# EAGLE design H07R8 (EAGLE 9.6.1)

## Sheet 1 of 3: I/O parts
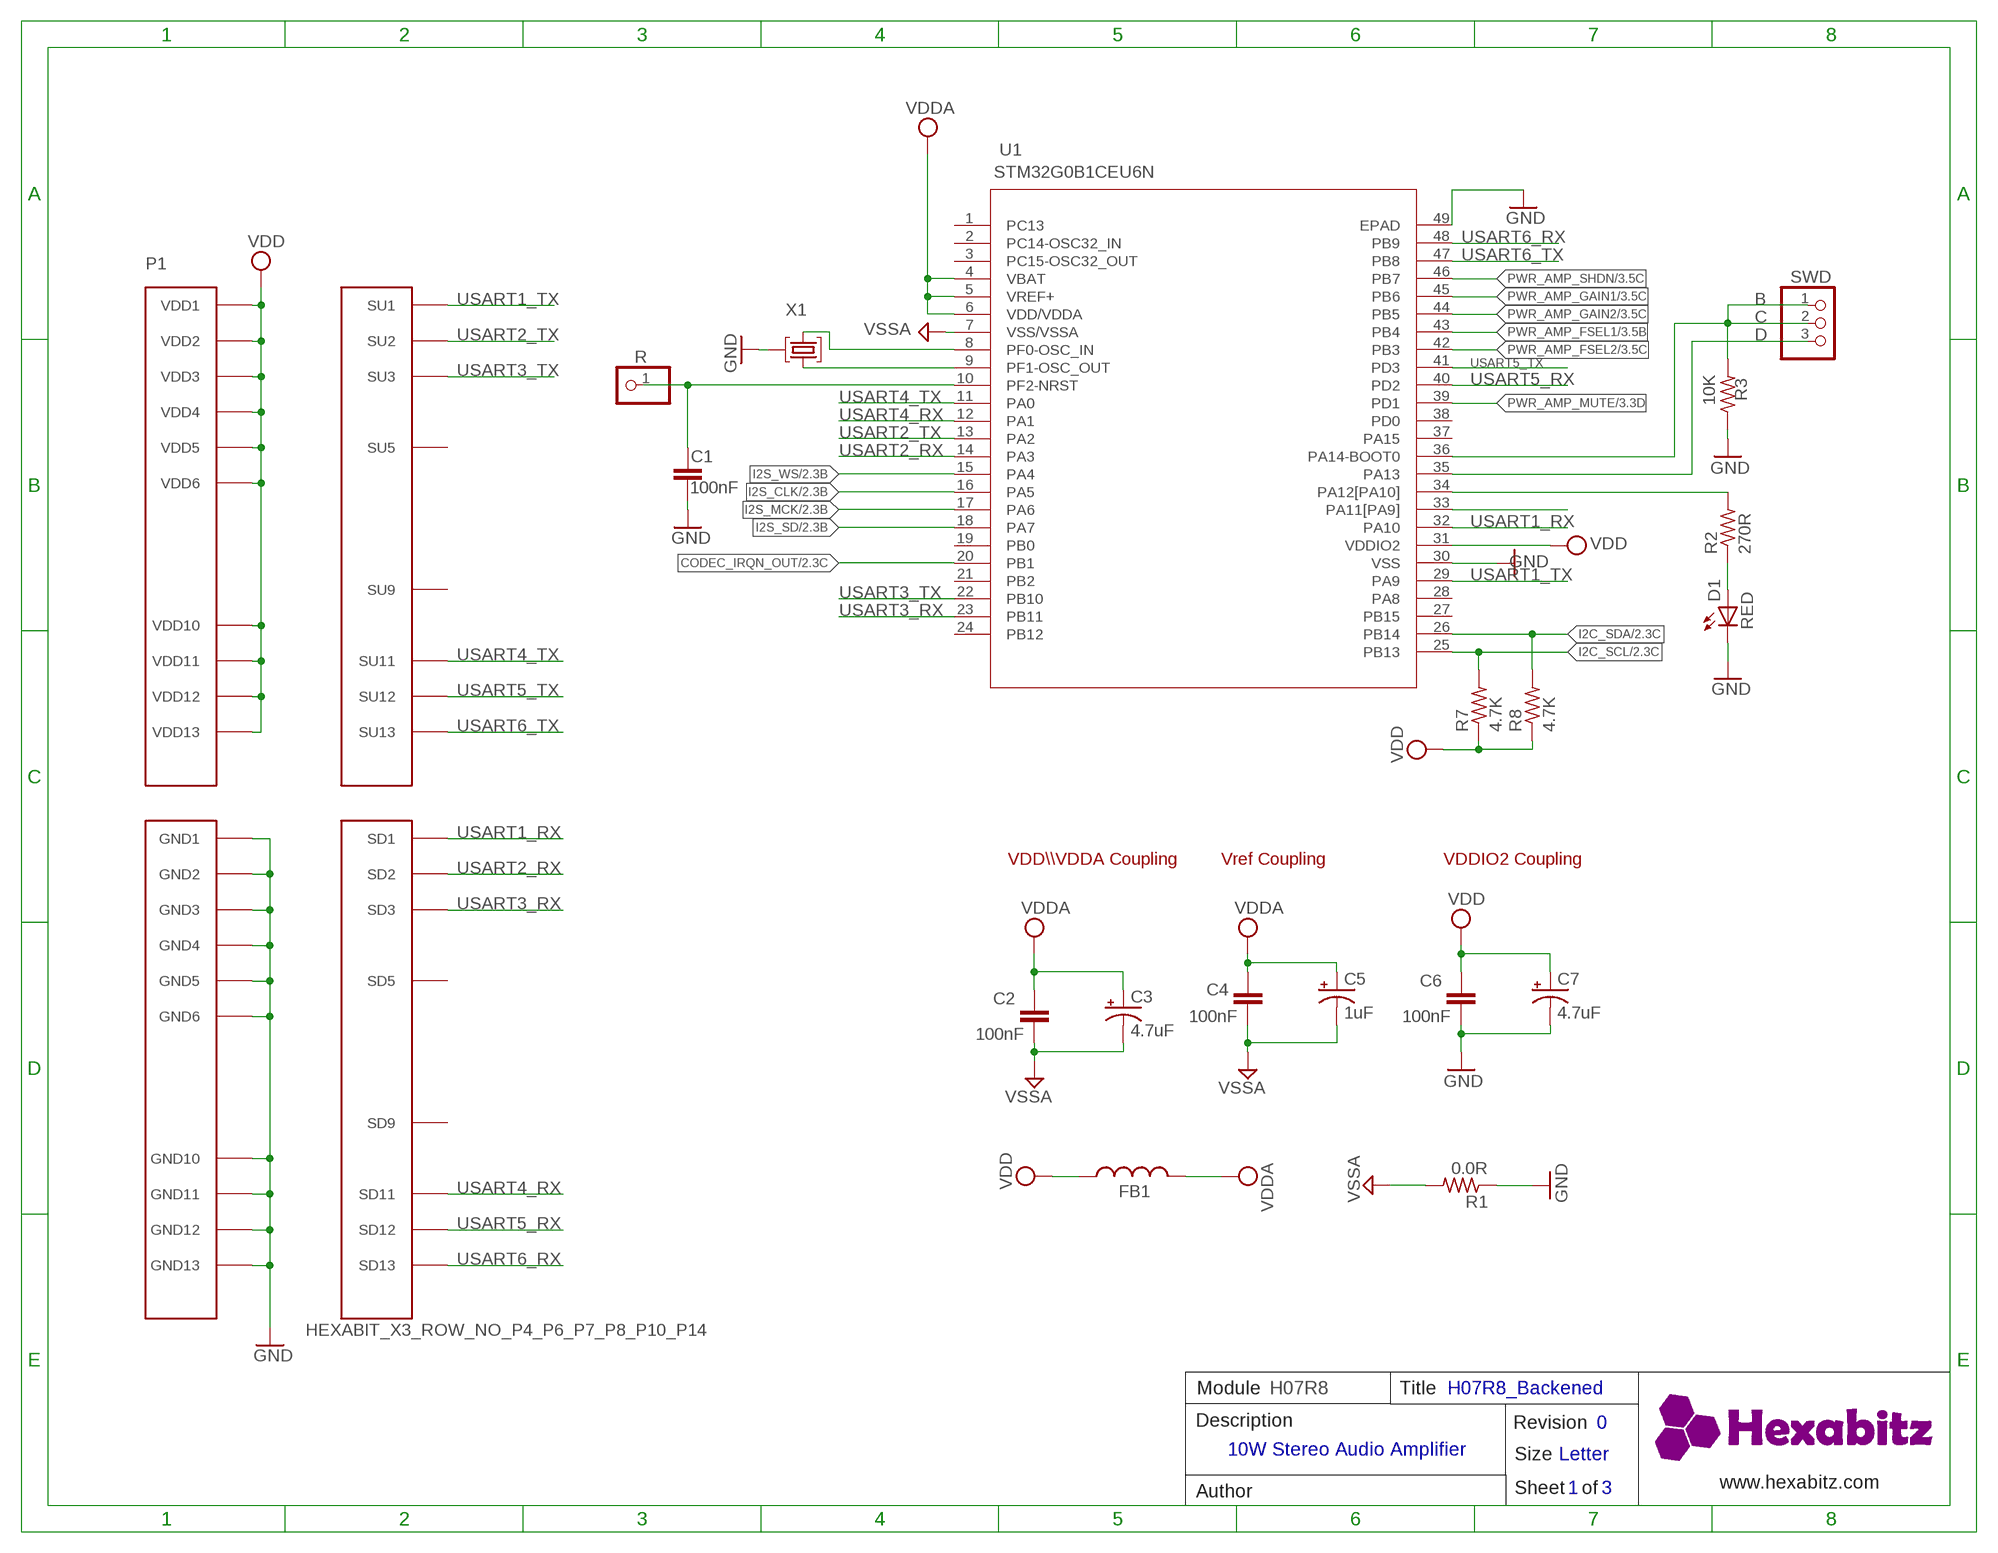
[diagram p0: schematic, sheet 1]

### Parts
C1  100nF  C-0603  [C-0603]
C2  100nF  C-0603  [C-0603]
C3  4.7uF  C-0805-POL  [C-0805-POL]
C4  100nF  C-0603  [C-0603]
C5  1uF  C-0805-POL  [C-0805-POL]
C6  100nF  C-0603  [C-0603]
C7  4.7uF  C-0805-POL  [C-0805-POL]
D1  RED  VLMS1300-GS08  [VLMS1300-GS08]
FB1  FB-TDK_MMZ1608Y300B  [FB-TDK_MMZ1608Y300B]
P1  HEXABIT_X3_ROW_NO_P4_P6_P7_P8_P10_P14  [HEXABIT_X3_ROW_NO_P4_P6_P7_P8_P10_P14]
R  PINHD-1X1  [1X01]
R1  0.0R  R-0603  [R-0603]
R2  270R  R-0603  [R-0603]
R3  10K  R-0603  [R-0603]
R7  4.7K  R-0603  [R-0603]
R8  4.7K  R-0603  [R-0603]
SWD  PINHD-1X3  [1X03]
U1  STM32G0B1CEU6N  [HEXABITZ_ICS_QFN_B1CEU6_STM-L]
X1  8MHZ  XTALL_CSTCE8M00G52  [XTALL_CSTCE8M00G52]

### Nets
C: R3.2 SWD.1 SWD.2 U1.36(PA14-BOOT0)
CODEC_IRQN_OUT: U1.20(PB1) ; also sheet 2
D: SWD.3 U1.35(PA13)
GND: C1.1 C6.1 C7.2(-) D1.C P1.PAD_PD15(GND1) P1.PAD_PD16(GND2) P1.PAD_PD17(GND3) P1.PAD_PD18(GND4) P1.PAD_PD19(GND5) P1.PAD_PD24(GND6) P1.PAD_PD25(GND10) P1.PAD_PD26(GND11) P1.PAD_PD27(GND12) P1.PAD_PD28(GND13) R1.1 R3.1 U1.30(VSS) U1.49(EPAD) X1.P$2
GND1: C2.1 C3.2(-) C4.1 C5.2(-) R1.2 U1.7(VSS/VSSA) ; supply symbol labelled VSSA ; also sheet 2,3
I2C_SCL: R7.2 U1.25(PB13) ; also sheet 2
I2C_SDA: R8.2 U1.26(PB14) ; also sheet 2
I2S_CLK: U1.16(PA5) ; also sheet 2
I2S_MCK: U1.17(PA6) ; also sheet 2
I2S_SD: U1.18(PA7) ; also sheet 2
I2S_WS: U1.15(PA4) ; also sheet 2
N$1: U1.8(PF0-OSC_IN) X1.P$1
N$2: U1.9(PF1-OSC_OUT) X1.P$3
N$3: R2.2 U1.34(PA12[PA10])
N$4: D1.A R2.1
N$12: C1.2 R.1 U1.10(PF2-NRST)
N$45: U1.33(PA11[PA9])
PWR_AMP_FSEL1: U1.43(PB4) ; also sheet 3
PWR_AMP_FSEL2: U1.42(PB3) ; also sheet 3
PWR_AMP_GAIN1: U1.45(PB6) ; also sheet 3
PWR_AMP_GAIN2: U1.44(PB5) ; also sheet 3
PWR_AMP_MUTE: U1.39(PD1) ; also sheet 3
PWR_AMP_SHDN: U1.46(PB7) ; also sheet 3
USART1_RX: P1.PAD_PD1(SD1) U1.32(PA10)
USART1_TX: P1.PAD_PU1(SU1) U1.29(PA9)
USART2_RX: P1.PAD_PD2(SD2) U1.14(PA3)
USART2_TX: P1.PAD_PU2(SU2) U1.13(PA2)
USART3_RX: P1.PAD_PD3(SD3) U1.23(PB11)
USART3_TX: P1.PAD_PU3(SU3) U1.22(PB10)
USART4_RX: P1.PAD_PD11(SD11) U1.12(PA1)
USART4_TX: P1.PAD_PU11(SU11) U1.11(PA0)
USART5_RX: P1.PAD_PD12(SD12) U1.40(PD2)
USART5_TX: P1.PAD_PU12(SU12) U1.41(PD3)
USART6_RX: P1.PAD_PD13(SD13) U1.48(PB9)
USART6_TX: P1.PAD_PU13(SU13) U1.47(PB8)
VDD: C6.2 C7.1(+) FB1.1 P1.PAD_PU15(VDD1) P1.PAD_PU16(VDD2) P1.PAD_PU17(VDD3) P1.PAD_PU18(VDD4) P1.PAD_PU19(VDD5) P1.PAD_PU24(VDD6) P1.PAD_PU25(VDD10) P1.PAD_PU26(VDD11) P1.PAD_PU27(VDD12) P1.PAD_PU28(VDD13) R7.1 R8.1 U1.31(VDDIO2) ; also sheet 2,3
VDDA: C2.2 C3.1(+) C4.2 C5.1(+) FB1.2 U1.4(VBAT) U1.5(VREF+) U1.6(VDD/VDDA)
Unconnected: P1.PAD_PD5(SD5) P1.PAD_PD9(SD9) P1.PAD_PU9(SU5) P1.PAD_PU10(SU9) U1.1(PC13) U1.2(PC14-OSC32_IN) U1.3(PC15-OSC32_OUT) U1.19(PB0) U1.21(PB2) U1.24(PB12) U1.27(PB15) U1.28(PA8) U1.37(PA15) U1.38(PD0)

### Notes on the sheet
- B
- VDD\\\VDDA Coupling | Vref Coupling | VDDIO2 Coupling
- Module | H07R8 | Title | H07R8_Backened
- Description | Revision | 0
- 10W Stereo Audio Amplifier
- Size | Letter
- www.hexabitz.com
- Author | Sheet   of | 1 | 3

## Sheet 2 of 3
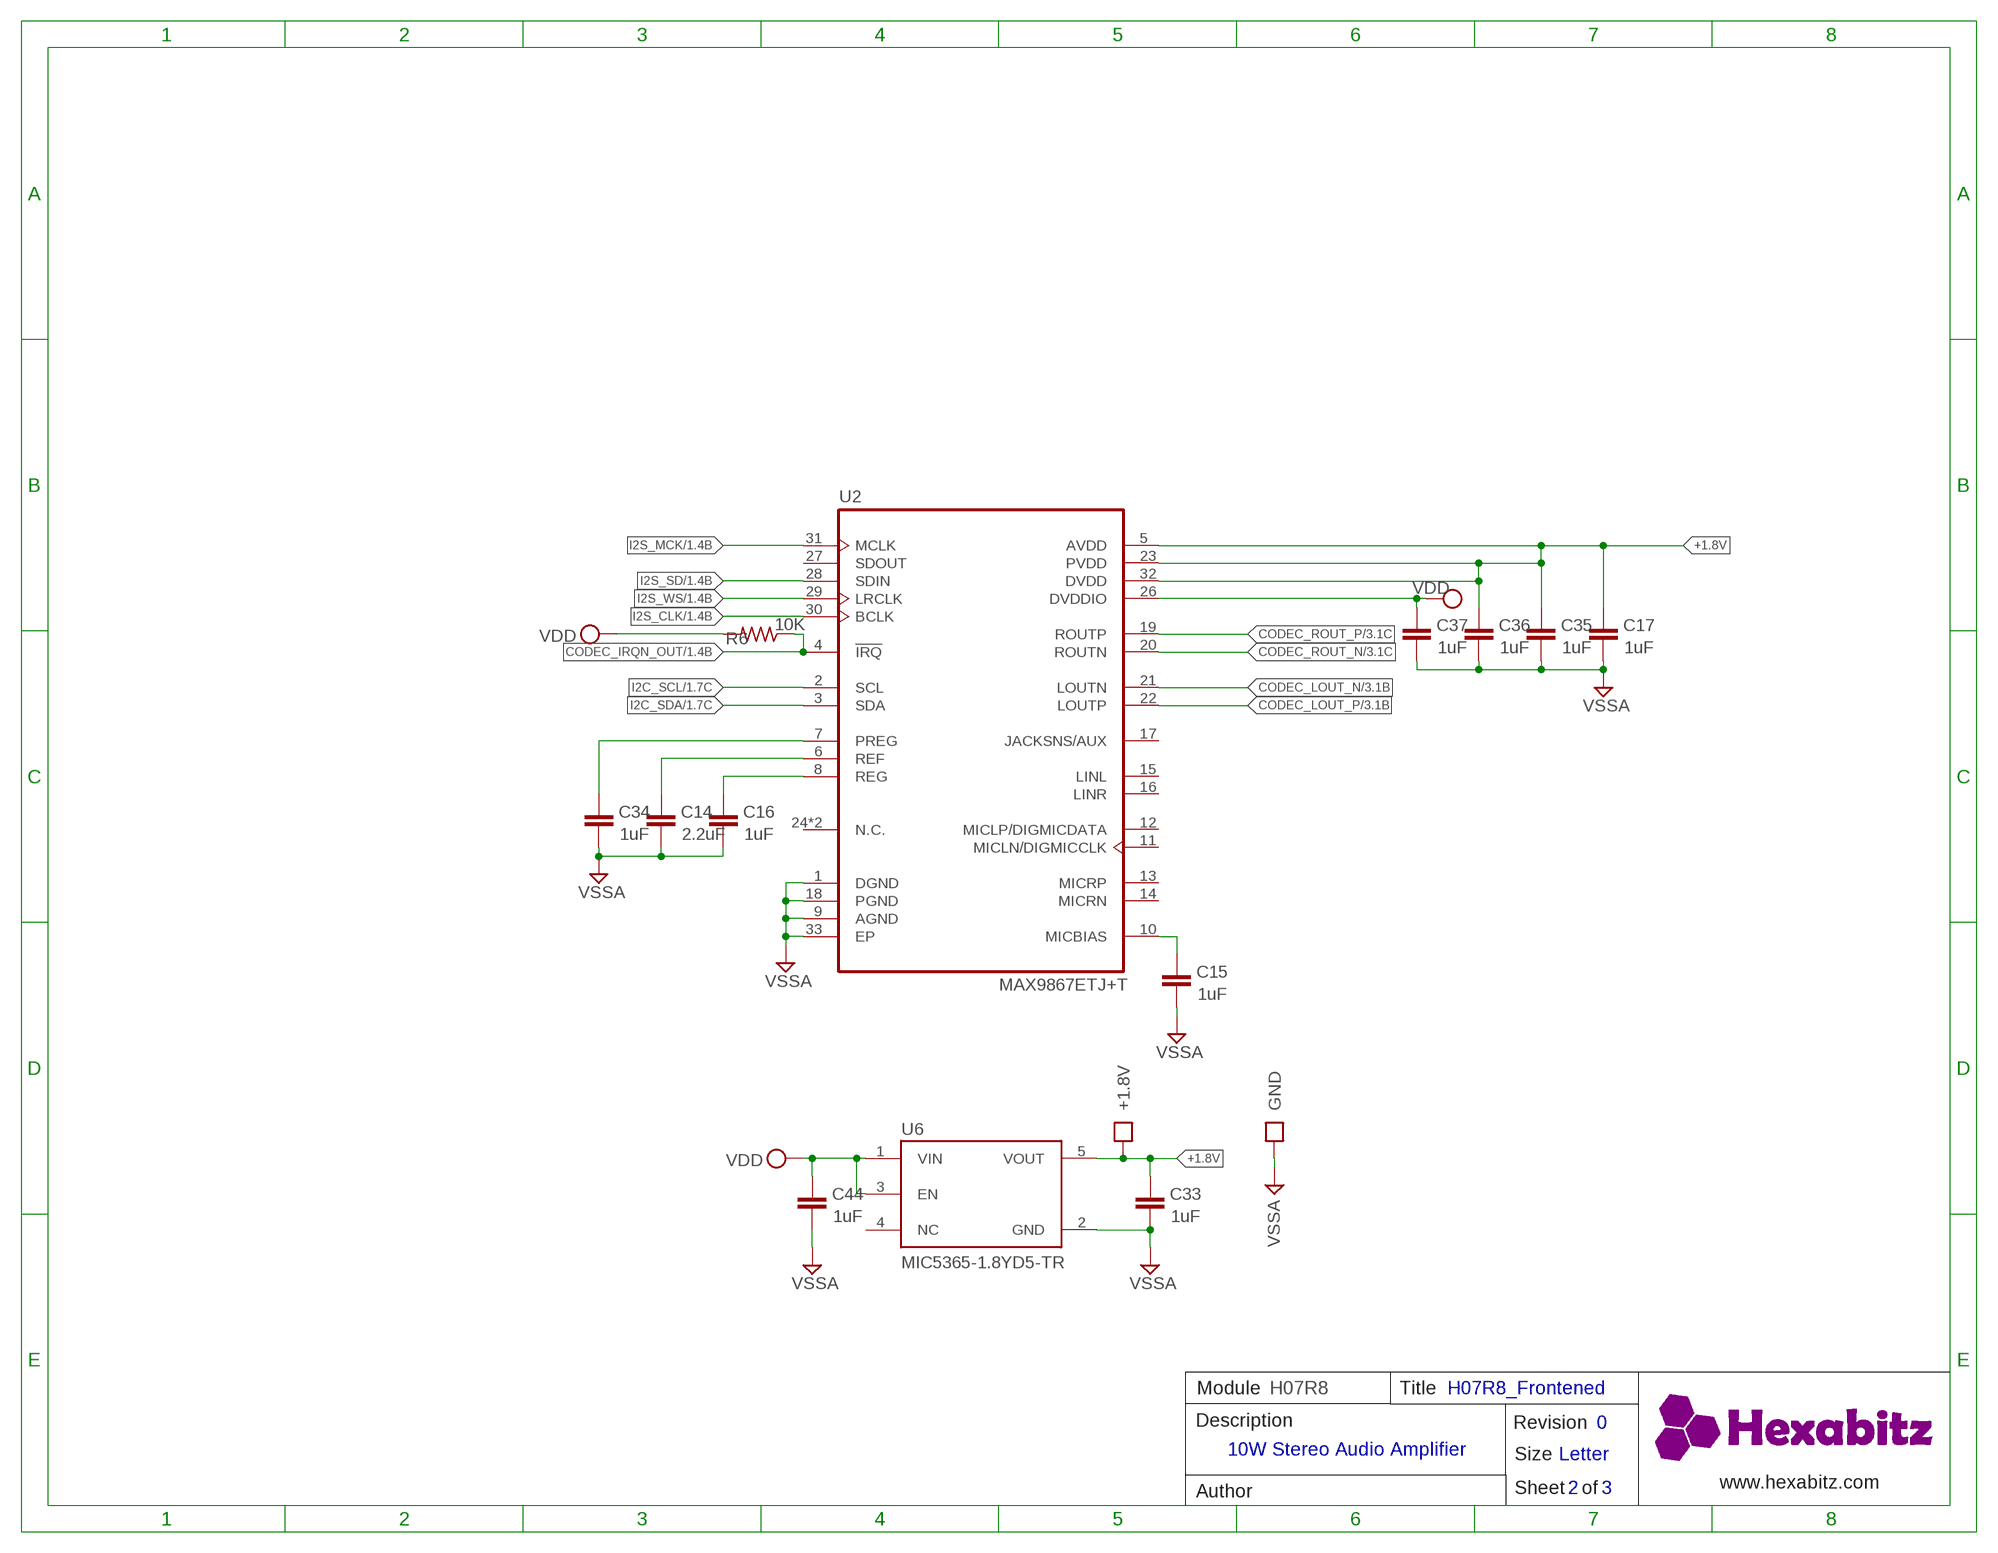
[diagram p1: schematic, sheet 2]

### Parts
+1.8V  PAD4  [PAD4]
C14  2.2uF  C-0603  [C-0603]
C15  1uF  C-0603  [C-0603]
C16  1uF  C-0603  [C-0603]
C17  1uF  C-0603  [C-0603]
C33  1uF  C-0603  [C-0603]
C34  1uF  C-0603  [C-0603]
C35  1uF  C-0603  [C-0603]
C36  1uF  C-0603  [C-0603]
C37  1uF  C-0603  [C-0603]
C44  1uF  C-0603  [C-0603]
GND  PAD4  [PAD4]
R6  10K  R-0603  [R-0603]
U2  MAX9867ETJ+T  [QFN50P500X500X80-33N]
U6  MIC5365-1.8YD5-TRMICROCHIP_MIC5365-1_8YD5-TR_0_0  [MICROCHIP_MIC5365-1_8YD5-TR_0]

### Nets
+1.8V: +1.8V.P$1 C17.2 C33.2 C35.2 C36.2 U2.5(AVDD) U2.23(PVDD) U2.32(DVDD) U6.5(VOUT)
CODEC_IRQN_OUT: R6.1 U2.4(!IRQ) ; also sheet 1
CODEC_LOUT_N: U2.21(LOUTN) ; also sheet 3
CODEC_LOUT_P: U2.22(LOUTP) ; also sheet 3
CODEC_ROUT_N: U2.20(ROUTN) ; also sheet 3
CODEC_ROUT_P: U2.19(ROUTP) ; also sheet 3
GND1: C14.1 C15.1 C16.1 C17.1 C33.1 C34.1 C35.1 C36.1 C37.1 C44.1 GND.P$1 U2.1(DGND) U2.9(AGND) U2.18(PGND) U2.33(EP) U6.2(GND) ; supply symbol labelled VSSA ; also sheet 1,3
I2C_SCL: U2.2(SCL) ; also sheet 1
I2C_SDA: U2.3(SDA) ; also sheet 1
I2S_CLK: U2.30(BCLK) ; also sheet 1
I2S_MCK: U2.31(MCLK) ; also sheet 1
I2S_SD: U2.28(SDIN) ; also sheet 1
I2S_WS: U2.29(LRCLK) ; also sheet 1
N$23: C16.2 U2.8(REG)
N$24: C14.2 U2.6(REF)
N$25: C34.2 U2.7(PREG)
N$35: C15.2 U2.10(MICBIAS)
VDD: C37.2 C44.2 R6.2 U2.26(DVDDIO) U6.1(VIN) U6.3(EN) ; also sheet 1,3
Unconnected: U2.11(MICLN/DIGMICCLK) U2.12(MICLP/DIGMICDATA) U2.13(MICRP) U2.14(MICRN) U2.15(LINL) U2.16(LINR) U2.17(JACKSNS/AUX) U2.24(N.C.) U2.25(N.C.) U2.27(SDOUT) U6.4(NC)

### Notes on the sheet
- Module | H07R8 | Title | H07R8_Frontened
- Description | Revision | 0
- 10W Stereo Audio Amplifier
- Size | Letter
- www.hexabitz.com
- Author | Sheet   of | 2 | 3

## Sheet 3 of 3
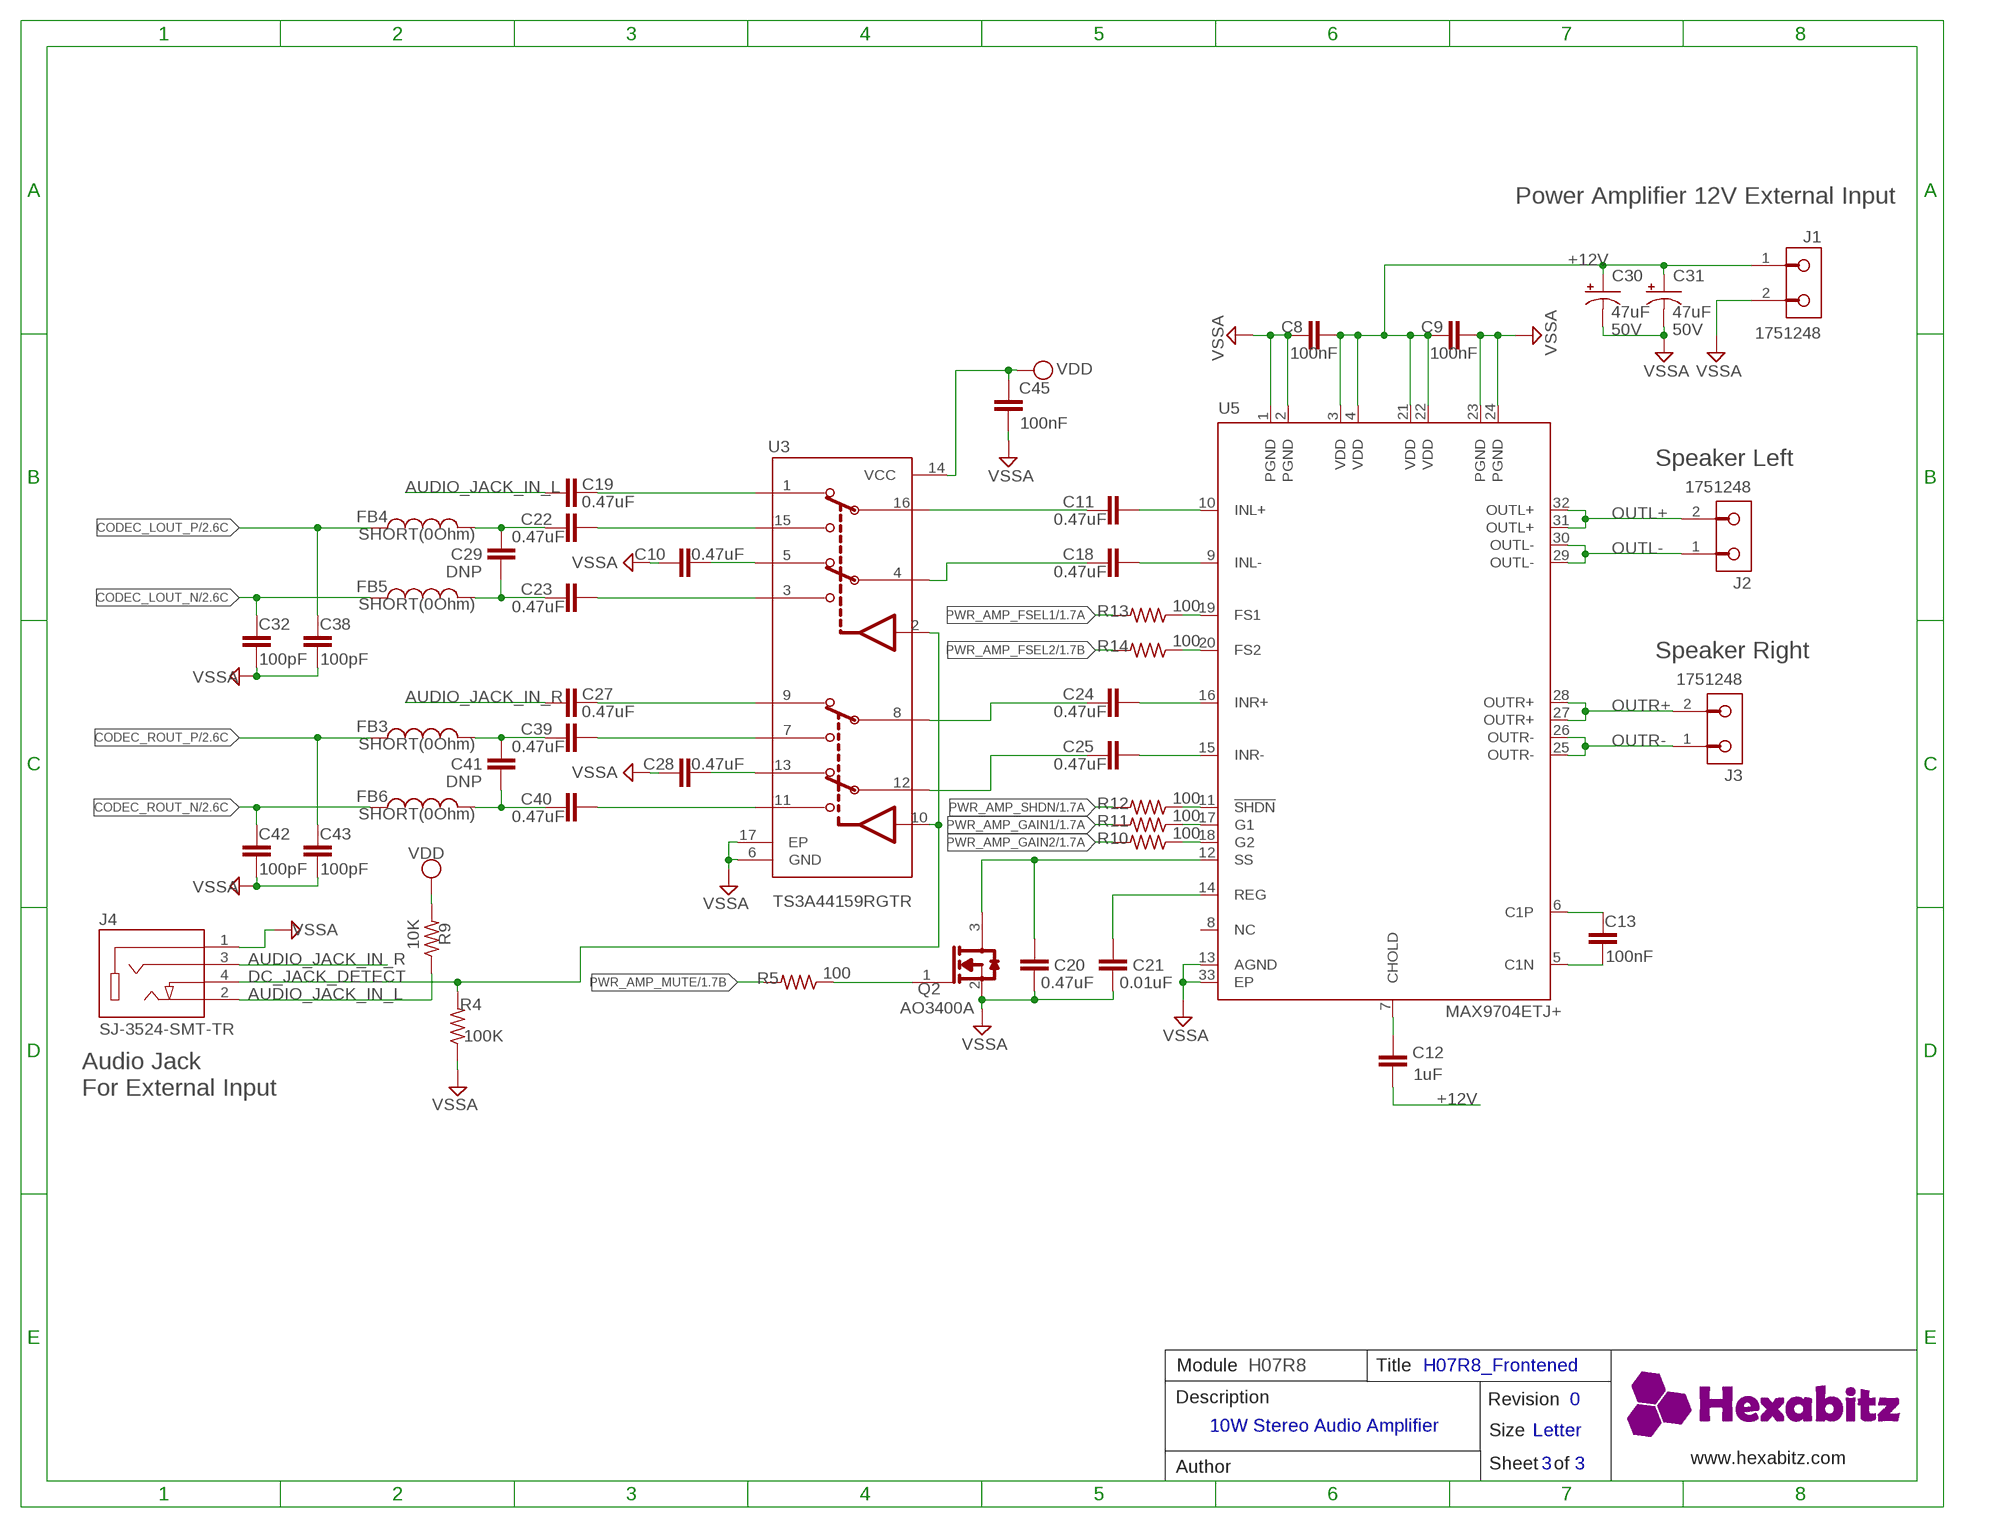
[diagram p2: schematic, sheet 3]

### Parts
C8  100nF  C-0603  [C-0603]
C9  100nF  C-0603  [C-0603]
C10  0.47uF  C-0603  [C-0603]
C11  0.47uF  C-0603  [C-0603]
C12  1uF  C-0603  [C-0603]
C13  100nF  C-0603  [C-0603]
C18  0.47uF  C-0603  [C-0603]
C19  0.47uF  C-0603  [C-0603]
C20  0.47uF  C-0603  [C-0603]
C21  0.01uF  C-0603  [C-0603]
C22  0.47uF  C-0603  [C-0603]
C23  0.47uF  C-0603  [C-0603]
C24  0.47uF  C-0603  [C-0603]
C25  0.47uF  C-0603  [C-0603]
C27  0.47uF  C-0603  [C-0603]
C28  0.47uF  C-0603  [C-0603]
C29  DNP  C-0603  [C-0603]
C30  47uF  A780EN476M1HLAS050  [PANASONIC_D]
C31  47uF  A780EN476M1HLAS050  [PANASONIC_D]
C32  100pF  C-0603  [C-0603]
C38  100pF  C-0603  [C-0603]
C39  0.47uF  C-0603  [C-0603]
C40  0.47uF  C-0603  [C-0603]
C41  DNP  C-0603  [C-0603]
C42  100pF  C-0603  [C-0603]
C43  100pF  C-0603  [C-0603]
C45  100nF  C-0603  [C-0603]
FB3  SHORT(0Ohm)  FB-0603  [FB-0603]
FB4  SHORT(0Ohm)  FB-0603  [FB-0603]
FB5  SHORT(0Ohm)  FB-0603  [FB-0603]
FB6  SHORT(0Ohm)  FB-0603  [FB-0603]
J1  1751248PHOENIX_CONTACT_1751248_0_0  [PHOENIX_CONTACT_1751248_0]
J2  1751248PHOENIX_CONTACT_1751248_0_0  [PHOENIX_CONTACT_1751248_0]
J3  1751248PHOENIX_CONTACT_1751248_0_0  [PHOENIX_CONTACT_1751248_0]
J4  SJ-3524-SMT-TR  SJ-3524-SMT-TRU  [CUI_SJ-3524-SMT]
Q2  AO3400AALPHA_&_OMEGA_SEMICONDUCTOR_AO3400A_0_0  [ALPHA_&_OMEGA_SEMICONDUCTOR_AO3400A_0]
R4  100K  R-0603  [R-0603]
R5  100  R-0603  [R-0603]
R9  10K  R-0603  [R-0603]
R10  100  R-0603  [R-0603]
R11  100  R-0603  [R-0603]
R12  100  R-0603  [R-0603]
R13  100  R-0603  [R-0603]
R14  100  R-0603  [R-0603]
U3  TS3A44159RGTRTEXAS_INSTRUMENTS_TS3A44159RGTR_0_0  [TEXAS_INSTRUMENTS_TS3A44159RGTR_0]
U5  MAX9704ETJ+  [QFN65P700X700X80-33N]

### Nets
+12V: C8.1 C9.2 C12.1 C30.+ C31.+ J1.1 U5.3(VDD) U5.4(VDD) U5.21(VDD) U5.22(VDD)
AUDIO_JACK_IN_L: C19.1 J4.2 R9.1
AUDIO_JACK_IN_R: C27.1 J4.3
CODEC_LOUT_N: C32.2 FB5.1 ; also sheet 2
CODEC_LOUT_P: C38.2 FB4.1 ; also sheet 2
CODEC_ROUT_N: C42.2 FB6.1 ; also sheet 2
CODEC_ROUT_P: C43.2 FB3.1 ; also sheet 2
DC_JACK_DETECT: J4.4 R4.2 U3.2(IN1-2) U3.10(IN3-4)
GND1: C8.2 C9.1 C10.1 C20.2 C21.2 C28.1 C30.- C31.- C32.1 C38.1 C42.1 C43.1 C45.2 J1.2 J4.1 Q2.2(S) R4.1 U3.6(GND) U3.17(EP) U5.1(PGND) U5.2(PGND) U5.13(AGND) U5.23(PGND) U5.24(PGND) U5.33(EP) ; supply symbol labelled VSSA ; also sheet 1,2
N$5: C40.1 C41.1 FB6.2
N$6: C21.1 U5.14(REG)
N$7: C12.2 U5.7(CHOLD)
N$8: C22.2 U3.15(NO1)
N$9: C23.2 U3.3(NO2)
N$10: C13.1 U5.6(C1P)
N$11: C39.2 U3.7(NO3)
N$13: C40.2 U3.11(NO4)
N$14: C19.2 U3.1(NC1)
N$15: C13.2 U5.5(C1N)
N$17: C27.2 U3.9(NC3)
N$18: C22.1 C29.2 FB4.2
N$19: C23.1 C29.1 FB5.2
N$20: C39.1 C41.2 FB3.2
N$21: C10.2 U3.5(NC2)
N$22: C28.2 U3.13(NC4)
N$26: C11.2 U5.10(INL+)
N$27: C11.1 U3.16(COM1)
N$28: C18.1 U3.4(COM2)
N$29: C24.1 U3.8(COM3)
N$30: C25.1 U3.12(COM4)
N$33: C18.2 U5.9(INL-)
N$34: C24.2 U5.16(INR+)
N$36: C20.1 Q2.3(D) U5.12(SS)
N$37: C25.2 U5.15(INR-)
N$39: R13.1 U5.19(FS1)
N$40: R14.1 U5.20(FS2)
N$41: R12.1 U5.11(!SHDN!)
N$42: R11.1 U5.17(G1)
N$43: R10.1 U5.18(G2)
N$44: Q2.1(G) R5.1
OUTL+: J2.2 U5.31(OUTL+) U5.32(OUTL+)
OUTL-: J2.1 U5.29(OUTL-) U5.30(OUTL-)
OUTR+: J3.2 U5.27(OUTR+) U5.28(OUTR+)
OUTR-: J3.1 U5.25(OUTR-) U5.26(OUTR-)
PWR_AMP_FSEL1: R13.2 ; also sheet 1
PWR_AMP_FSEL2: R14.2 ; also sheet 1
PWR_AMP_GAIN1: R11.2 ; also sheet 1
PWR_AMP_GAIN2: R10.2 ; also sheet 1
PWR_AMP_MUTE: R5.2 ; also sheet 1
PWR_AMP_SHDN: R12.2 ; also sheet 1
VDD: C45.1 R9.2 U3.14(VCC) ; also sheet 1,2
Unconnected: U5.8(NC)

### Notes on the sheet
- Power Amplifier 12V External Input
- Speaker Left
- Speaker Right
- Audio Jack
  For External Input
- Module | H07R8 | Title | H07R8_Frontened
- Description | Revision | 0
- 10W Stereo Audio Amplifier
- Size | Letter
- www.hexabitz.com
- Author | Sheet   of | 3 | 3

## Library data of the parts
+1.8V GND = HEXABITZ_CONNECTION_PARTS:PAD4
C1 = HEXABITZ_RCLS:C-0603: CAP CER 10% X7R 0603; CAPACITANCE: 100nF; MFN: AVX CORPORATION; MPN: 0603YC104K4T2A; OCTOPART_URL: 'https://octopart.com/0603yc104k4t2a-avx+interconnect+%2F+elco-8120651; TOLERANCE: 10%; VOLTAGE_RATING: 16.0 V
C2 C4 C6 = HEXABITZ_RCLS:C-0603: CAP CER 10% X7R 0603; CAPACITANCE: 100nF; MFN: AVX CORPORATION; MPN: '0603YC104K4T2A; OCTOPART_URL: 'https://octopart.com/0603yc104k4t2a-avx+interconnect+%2F+elco-8120651; TOLERANCE: 10%; VOLTAGE_RATING: 16.0 V
C3 = HEXABITZ_RCLS:C-0805-POL: Cap Tant Solid SMD 2012; CAPACITANCE: 4.7uF; MFN: 'Panasonic; MPN: '10TPU4R7MSI; OCTOPART_URL: https://octopart.com/10tpu4r7msi-panasonic-29487748?r=sp; TOLERANCE: 20%; VOLTAGE_RATING: 10.0 V
C5 = HEXABITZ_RCLS:C-0805-POL: Cap Tant Solid SMD 2012; CAPACITANCE: 4.7uF; MFN: 'YAGEO [VA]; MPN: 'CC0805KKX7R7BB105; OCTOPART_URL: 'https://octopart.com/cc0805kkx7r7bb105-yageo-8376555?r=sp; TOLERANCE: 20%; VOLTAGE_RATING: 10.0 V
C7 = HEXABITZ_RCLS:C-0805-POL: Cap Tant Solid SMD 2012; CAPACITANCE: 1.00uF; MFN: 'Panasonic; MPN: '10TPU4R7MSI; OCTOPART_URL: https://octopart.com/10tpu4r7msi-panasonic-29487748?r=sp; TOLERANCE: 10%; VOLTAGE_RATING: 16.0 V
C8 C9 C13 C45 = HEXABITZ_RCLS:C-0603: CAP CER 10% X7R 0603; CAPACITANCE: 100nF; MFN: Samsung Electro-Mechanics; MPN: CL10B104KA8NNNC; OCTOPART_URL: https://octopart.com/cl10b104ka8nnnc-samsung-19831573?r=sp; TOLERANCE: 10%; VOLTAGE_RATING: 25.0 V
C10 C11 C18-C20 C22-C25 C27 C28 C39 C40 = HEXABITZ_RCLS:C-0603: CAP CER 10% X7R 0603; CAPACITANCE: 0.47uF; MFN: TDK Corporation; MPN: C1608X5R1E474K080AC; OCTOPART_URL: https://octopart.com/c1608x5r1e474k080ac-tdk-25947645?r=sp; TOLERANCE: 10%; VOLTAGE_RATING: 25.0 V
C12 C15-C17 C33-C37 C44 = HEXABITZ_RCLS:C-0603: CAP CER 10% X7R 0603; CAPACITANCE: 1uF; MFN: Taiyo Yuden; MPN: UMK107BJ105KA-T; OCTOPART_URL: https://octopart.com/search?q=UMK107BJ105KA-T&currency=USD&specs=0; TOLERANCE: 10%; VOLTAGE_RATING: 50V
C14 = HEXABITZ_RCLS:C-0603: CAP CER 10% X7R 0603; CAPACITANCE: 2.2uF; MFN: Samsung Electro-Mechanics; MPN: CL10A225KO8NNNC; OCTOPART_URL: https://octopart.com/search?q=CL10A225KO8NNNC&currency=USD&specs=0; TOLERANCE: 10%; VOLTAGE_RATING: 16V
C21 = HEXABITZ_RCLS:C-0603: CAP CER 10% X7R 0603; CAPACITANCE: 0.01uF; MFN: YAGEO; MPN: CC0603KRX7R9BB103; OCTOPART_URL: https://octopart.com/cc0603krx7r9bb103-yageo-192938?r=sp; TOLERANCE: 10%; VOLTAGE_RATING: 50.0 V
C29 C41 = HEXABITZ_RCLS:C-0603: CAP CER 10% X7R 0603
C30 C31 = HEXABITZ_RCLS:A780EN476M1HLAS050: CAP ALUM HYB 47UF 20% 50V SMD; CAPACITANCE: 47uF; DESCRIPTION: CAP ALUM HYB 47UF 20% 50V SMD; MNF: KEMET; MPN: A780EN476M1HLAS050; OCTOPART_URL: https://octopart.com/search?q=A780EN476M1HLAS050&currency=USD&specs=0; TOLERANCE: ±20%; VOLTAGE_RATING: 50V
C32 C38 C42 C43 = HEXABITZ_RCLS:C-0603: CAP CER 10% X7R 0603; CAPACITANCE: 100pF; MFN: YAGEO; MPN: CC0603KPX7R9BB101; OCTOPART_URL: https://octopart.com/cc0603kpx7r9bb101-yageo-25628258?r=sp; TOLERANCE: 10%; VOLTAGE_RATING: 50.0 V
D1 = HEXABITZ_USER_INTERFACE_PARTS:VLMS1300-GS08: Red 0603 130° Clear 54 mcd 2 V Surface Mount ChipLED ; Octopart Url : http://octopart.com/vlms1300-gs08-vishay-21709201; MFN: Vishay; MPN: VLMS1300-GS08; OCTOPART_URL: https://octopart.com/vlms1300-gs08-vishay-21709201?r=sp&s=0nXJNjGsSbWwqfqWlZv0EA
FB1 = HEXABITZ_RCLS:FB-TDK_MMZ1608Y300B: Ferrite Beads Multi-Layer 30Ohm 25% 100MHz 1.5A 50mOhm DCR 0603; MFN: TDK; MPN: MMZ1608Y300BTA00; OCTOPART_URL: https://octopart.com/mmz1608y300bta00-tdk-7906990?r=sp
FB3-FB6 = HEXABITZ_RCLS:FB-0603: Ferrite Beads Multi-Layer 0603; MFN: YAGEO; MPN: RC0603FR-070RL; OCTOPART_URL: https://octopart.com/rc0603fr-070rl-yageo-1180803?r=sp
J1-J3 = hexabitz_connectors:1751248: TERM BLK 2POS SIDE ENT 3.5MM PCB; AVAILABILITY: In Stock; MFG_PACKAGE_IDENT: 1751248; MNF: Phoenix Contact; MPN: 1751248; OCTOPART_URL: https://octopart.com/search?q=1751248&currency=USD&specs=0
J4 = HEXABITZ_ICs:SJ-3524-SMT-TR: https://octopart.com/search?q=SJ-3524-SMT-TR&currency=USD&specs=0; AVAILABILITY: In Stock; DESCRIPTION: CONN JACK STEREO 3.5MM SMD R/A; MNF: CUI Devices; MPN: SJ-3524-SMT-TR; OCTOPART_URL: https://octopart.com/search?q=SJ-3524-SMT-TR&currency=USD&specs=0; PRICE: 1.03
P1 = hexabitz_connectors:HEXABIT_X3_ROW_NO_P4_P6_P7_P8_P10_P14: Hexabitz Double Hexagon Module Connector Hexagon side length = 17.32mm. The following ports are removed: P5, P10, P11, P12
Q2 = HEXABITZ_ICs:AO3400A: MOSFET N-CH 30V 5.7A SOT23-3L; DESCRIPTION: MOSFET N-CH 30V 5.7A SOT23-3L; MNF: Alpha & Omega Semiconductor Inc.; MPN: AO3400A; OCTOPART_URL: https://octopart.com/ao3400a-alpha+%26+omega+semiconductor-10533924?r=spc#CadModels; PACKAGE: SOT23; PRICE: 0.44
R = HEXABITZ_USER_INTERFACE_PARTS:PINHD-1X1: PIN HEADER; MFN: TE Connectivity; MPN: 87227-1; OCTOPART_URL: https://octopart.com/87227-1-te+connectivity-39512052?r=sp
R1 = HEXABITZ_RCLS:R-0603: Thick Film Resistors - SMD 0603; MFN: YAGEO [VR]; MPN: RC0603JR-070RL; OCTOPART_URL: https://octopart.com/rc0603jr-070rl-yageo-1241539?r=sp; RESISTANCE: 0R
R2 = HEXABITZ_RCLS:R-0603: Thick Film Resistors - SMD 0603; MFN: 'Panasonic; MPN: 'ERJ-3GEYJ271V; OCTOPART_URL: https://octopart.com/erj-3geyj271v-panasonic-55560546?r=sp; RESISTANCE: 270R
R3 R6 R9 = HEXABITZ_RCLS:R-0603: Thick Film Resistors - SMD 0603; MFN: Vishay; MPN: '060300J0103T5E; OCTOPART_URL: https://octopart.com/search?q=060300J0103T5E&currency=USD&specs=0; RESISTANCE: 10K
R4 = HEXABITZ_RCLS:R-0603: Thick Film Resistors - SMD 0603; MFN: YAGEO; MPN: RC0603FR-10100KL; OCTOPART_URL: https://octopart.com/search?q=RC0603FR-10100KL&currency=USD&specs=0; RESISTANCE: 100K
R5 R10-R14 = HEXABITZ_RCLS:R-0603: Thick Film Resistors - SMD 0603; MFN: YAGEO; MPN: RMCF0603FT100R; OCTOPART_URL: https://octopart.com/search?q=RMCF0603FT100R&currency=USD&specs=0; RESISTANCE: 100
R7 R8 = HEXABITZ_RCLS:R-0603: Thick Film Resistors - SMD 0603; MFN: Stackpole Electronics Inc; MPN: RMCF0603FT4K70; OCTOPART_URL: https://octopart.com/search?q=RMCF0603FT4K70&currency=USD&specs=0; RESISTANCE: 4.7K; TOLERANCE: ±1%
SWD = pinhead:PINHD-1X3: PIN HEADER
U1 = HEXABITZ_ICs:STM32G0B1CEU6N
U2 = HEXABITZ_ICs:MAX9867ETJ+T: IC STEREO AUD CODEC LP 32TQFN; AVAILABILITY: In Stock; DESCRIPTION: IC STEREO AUD CODEC LP 32TQFN; MFN: Maxim Integrated Products; MPN: MAX9867ETJ+T; PACKAGE: 32-TQFN; PRICE: 3.72
U3 = HEXABITZ_ICs:TS3A44159RGTR: IC SWITCH SPDTX4 450MOHM 16VQFN; DESCRIPTION: IC SWITCH SPDTX4 450MOHM 16VQFN; DIGIKEY_PART_NUMBER: 296-21916-1-ND; MNF: Texas Instruments; MPN: TS3A44159RGTR; OCTOPART_URL: https://octopart.com/ts3a44159rgtr-texas+instruments-5447085?r=spc#CadModels; PACKAGE: 16VQFN
U5 = HEXABITZ_ICs:MAX9704ETJ+: IC AMP CLASS D STEREO 16W 32TQFN; AVAILABILITY: In Stock; DESCRIPTION: IC AMP CLASS D STEREO 16W 32TQFN; MFN: Analog Devices Inc./Maxim Integrated; MPN: MAX9704ETJ+; PACKAGE: 32-TQFN; PRICE: 5.86
U6 = HEXABITZ_ICs:MIC5365-1.8YD5-TR: Linear Voltage Regulator IC Positive Fixed 1 Output 150mA TSOT-23-5; AVAILABILITY: In Stock; DESCRIPTION: IC REG LIN 1.8V 150MA TSOT23-5; MFN: Microchip Technology; MPN: MIC5365-1.8YD5-TR; OCTOPART_URL: https://octopart.com/mic5365-1.8yd5-tr-microchip-66803184?r=spc#CadModels; PRICE: 0.22
X1 = HEXABITZ_OTHER_PARTS:XTALL_CSTCE8M00G52: MURATA CSTCE8M00G52-R0 RESONATOR, SMD, 8MHZ ; Octopart Url : https://octopart.com/cstce8m00g52-r0-murata-7145559; MFN: Murata; MPN: CSTNE8M00G550000R0; OCTOPART_URL: https://octopart.com/cstne8m00g550000r0-murata-91406934?r=sp

## Board
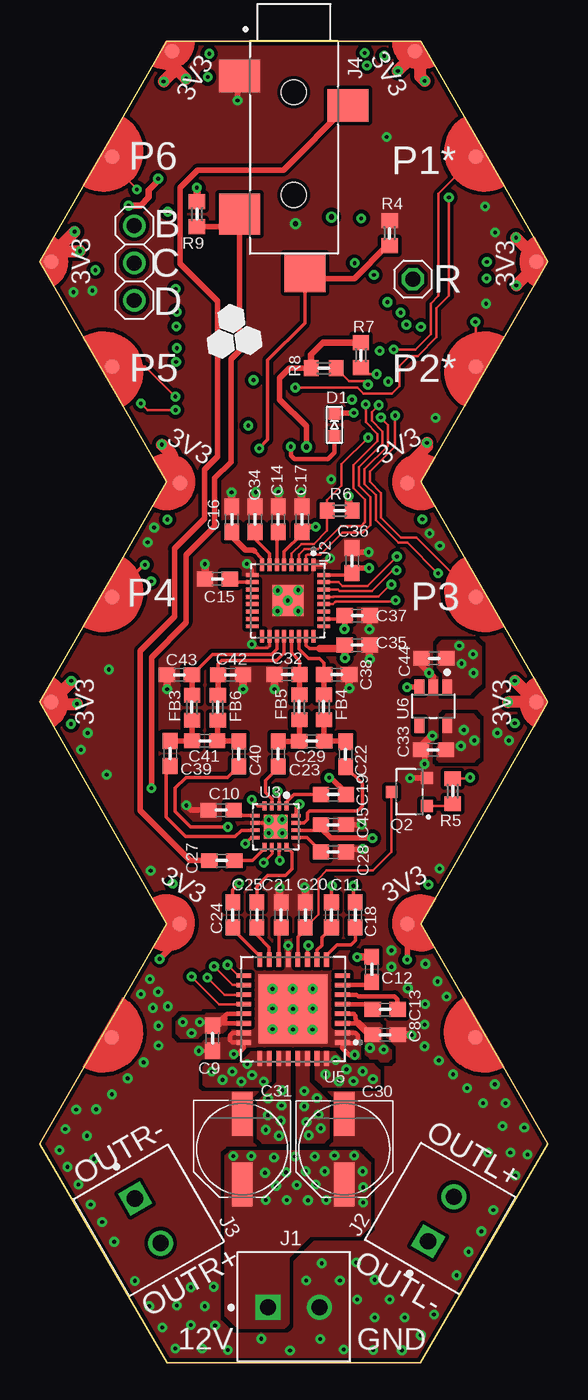
[diagram p3: board, top side]
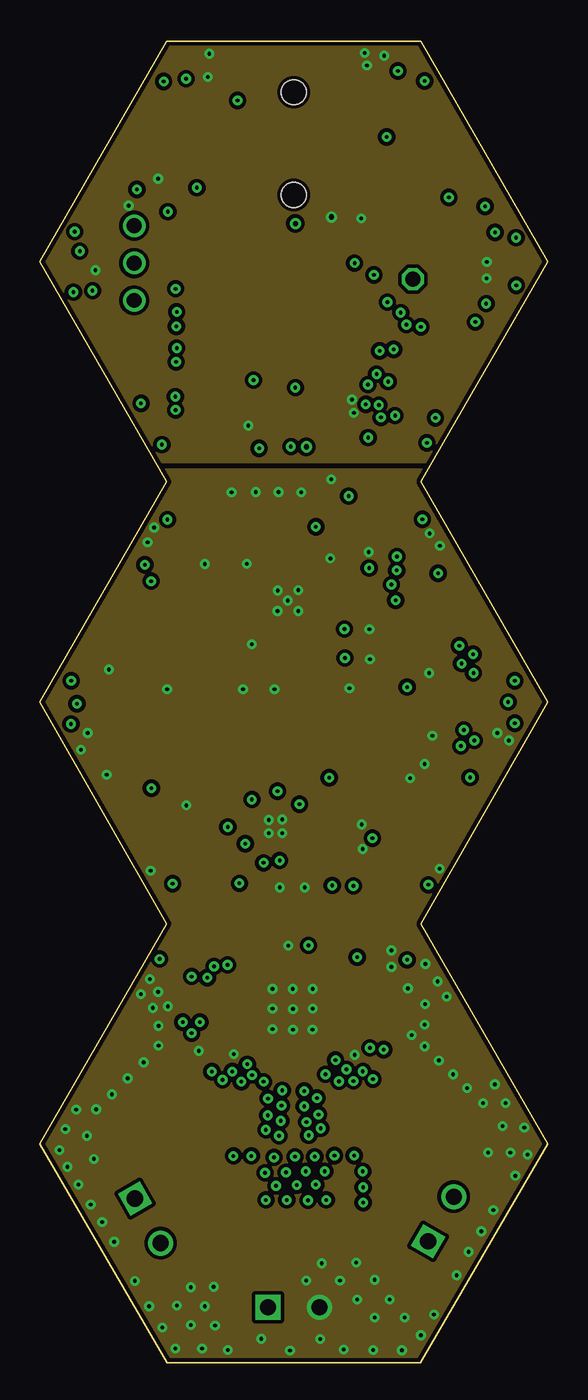
[diagram p4: board, inner layer Route2]
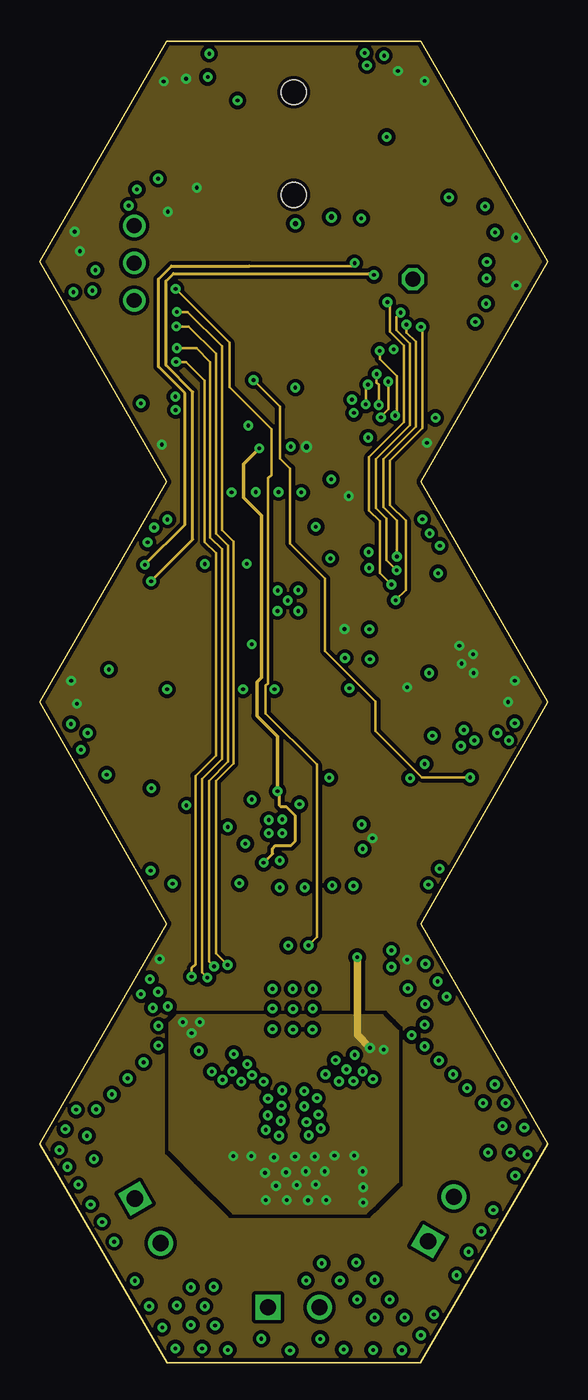
[diagram p5: board, inner layer Route15]
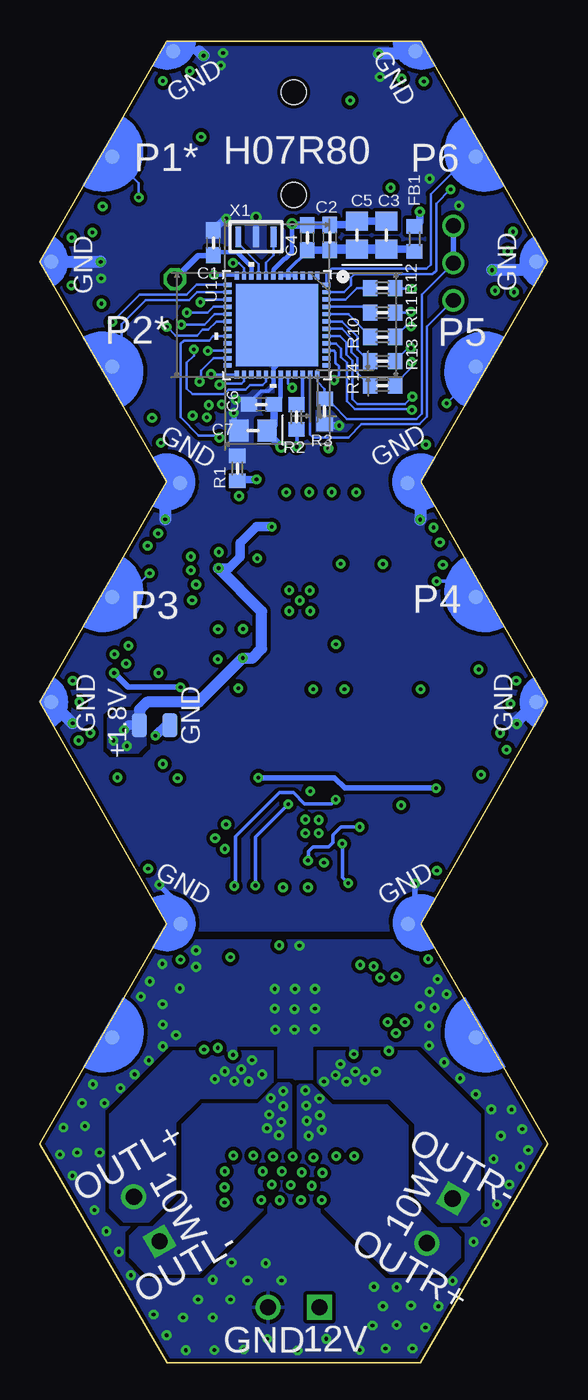
[diagram p6: board, bottom side, seen from below]

Size 34.64 x 89.99 mm. Coordinates in mm from the lower left corner, seen from the top.
Copper layers (1*2+15*16): Top 0.035mm / dielectric 0.175mm / Route2 0.035mm / dielectric 1.11mm / Route15 0.035mm / dielectric 0.175mm / Bottom 0.035mm
Design rules "4_layer *": minimum track width 7mil, minimum drill 10mil, track to track 7mil, track to pad 7mil, pad to pad 6mil, via to via 7mil, smd to smd 0mil, copper to edge 1mil, drill to drill 8mil, minimum pad ring 10mil, minimum via ring 8mil, stop-mask expansion 2mil, vias tented up to drill 15mil, thermal gap 10mil

### Footprints (pad centres in the part's own frame; a part is rotated, then mirrored left to right if it is on the bottom)
PAD4 = smd 1.6 x 1: P$1 0,0
C-0603 = smd 1.1 x 1: 1 -0.85,0; 2 0.85,0
C-0805-POL = smd 1.3 x 1.5: 1 -0.95,0; 2 0.95,0
PANASONIC_D = smd 3 x 1.4: + 2.4,0; - -2.4,0
VLMS1300-GS08 = smd 0.8 x 0.8: A 0,0.75; C 0,-0.75
FB-TDK_MMZ1608Y300B = smd 1 x 1.1: 1 -0.85,0; 2 0.85,0
FB-0603 = smd 1 x 1.1: 1 -0.85,0; 2 0.85,0
PHOENIX_CONTACT_1751248_0 = drill 1.1 pad 1.7 square: 1 -1.75,-0.05 | drill 1.1 pad 1.7: 2 1.75,-0.05
CUI_SJ-3524-SMT = smd 2.2 x 2.8: 1 -1.1,-3.7; 3 0.9,3.7 | smd 2.8 x 2.8: 2 8.3,-3.7 | smd 2.6 x 2.8: 4 12.3,0.75 | hole 1.7: 0,0; 7,0
HEXABIT_X3_ROW_NO_P4_P6_P7_P8_P10_P14 = smd 1 x 1 bottom: PAD_PD1 12.39,37.198; PAD_PD2 12.39,22.898; PAD_PD3 12.39,7.198; PAD_PD5 12.365,-22.797; PAD_PD9 -12.415,-22.797; PAD_PD11 -12.39,7.198; PAD_PD12 -12.39,22.898; PAD_PD13 -12.39,37.198; PAD_PD15 8.235,44.361; PAD_PD16 16.52,30.048; PAD_PD17 7.752,14.976; PAD_PD18 16.52,0.048; PAD_PD19 7.727,-15.047; PAD_PD24 -7.777,-15.047; PAD_PD25 -16.52,0.048; PAD_PD26 -7.752,14.976; PAD_PD27 -16.52,30.048; PAD_PD28 -8.285,44.361 | smd 1 x 1: PAD_PU1 12.39,37.198; PAD_PU2 12.39,22.898; PAD_PU3 12.39,7.198; PAD_PU9 -12.415,-22.797; PAD_PU10 12.365,-22.797; PAD_PU11 -12.39,7.198; PAD_PU12 -12.39,22.898; PAD_PU13 -12.39,37.198; PAD_PU15 8.235,44.361; PAD_PU16 16.52,30.048; PAD_PU17 7.752,14.976; PAD_PU18 16.52,0.048; PAD_PU19 7.727,-15.047; PAD_PU24 -7.777,-15.047; PAD_PU25 -16.52,0.048; PAD_PU26 -7.752,14.976; PAD_PU27 -16.52,30.048; PAD_PU28 -8.285,44.361
ALPHA_&_OMEGA_SEMICONDUCTOR_AO3400A_0 = smd 0.8 x 0.8: 1 -1.2,0.95; 2 -1.2,-0.95; 3 1.2,0
1X01 = drill 1.016 octagon: 1 0,0
R-0603 = smd 1 x 1.1: 1 -0.85,0; 2 0.85,0
1X03 = drill 1.016: 1 -2.54,0; 2 0,0; 3 2.54,0
HEXABITZ_ICS_QFN_B1CEU6_STM-L = smd 0.55 x 0.3: 1 -3.38,2.751; 2 -3.38,2.251; 3 -3.38,1.75; 4 -3.38,1.25; 5 -3.38,0.75; 6 -3.38,0.25; 7 -3.38,-0.25; 8 -3.38,-0.75; 9 -3.38,-1.25; 10 -3.38,-1.75; 11 -3.38,-2.251; 12 -3.38,-2.751; 25 3.38,-2.751; 26 3.38,-2.251; 27 3.38,-1.75; 28 3.38,-1.25; 29 3.38,-0.75; 30 3.38,-0.25; 31 3.38,0.25; 32 3.38,0.75; 33 3.38,1.25; 34 3.38,1.75; 35 3.38,2.251; 36 3.38,2.751 | smd 0.3 x 0.55: 13 -2.751,-3.38; 14 -2.251,-3.38; 15 -1.75,-3.38; 16 -1.25,-3.38; 17 -0.75,-3.38; 18 -0.25,-3.38; 19 0.25,-3.38; 20 0.75,-3.38; 21 1.25,-3.38; 22 1.75,-3.38; 23 2.251,-3.38; 24 2.751,-3.38; 37 2.751,3.38; 38 2.251,3.38; 39 1.75,3.38; 40 1.25,3.38; 41 0.75,3.38; 42 0.25,3.38; 43 -0.25,3.38; 44 -0.75,3.38; 45 -1.25,3.38; 46 -1.75,3.38; 47 -2.251,3.38; 48 -2.751,3.38 | smd 5.6 x 5.6: 49 0,0
QFN50P500X500X80-33N = smd 0.84 x 0.27: 1 -2.435,1.75; 2 -2.435,1.25; 3 -2.435,0.75; 4 -2.435,0.25; 5 -2.435,-0.25; 6 -2.435,-0.75; 7 -2.435,-1.25; 8 -2.435,-1.75; 17 2.435,-1.75; 18 2.435,-1.25; 19 2.435,-0.75; 20 2.435,-0.25; 21 2.435,0.25; 22 2.435,0.75; 23 2.435,1.25; 24 2.435,1.75 | smd 0.27 x 0.84: 9 -1.75,-2.435; 10 -1.25,-2.435; 11 -0.75,-2.435; 12 -0.25,-2.435; 13 0.25,-2.435; 14 0.75,-2.435; 15 1.25,-2.435; 16 1.75,-2.435; 25 1.75,2.435; 26 1.25,2.435; 27 0.75,2.435; 28 0.25,2.435; 29 -0.25,2.435; 30 -0.75,2.435; 31 -1.25,2.435; 32 -1.75,2.435 | smd 2.1 x 2.1: 33 0,0
TEXAS_INSTRUMENTS_TS3A44159RGTR_0 = smd 0.6 x 0.25: 1 -1.4,0.75; 2 -1.4,0.25; 3 -1.4,-0.25; 4 -1.4,-0.75; 9 1.4,-0.75; 10 1.4,-0.25; 11 1.4,0.25; 12 1.4,0.75 | smd 0.25 x 0.6: 5 -0.75,-1.4; 6 -0.25,-1.4; 7 0.25,-1.4; 8 0.75,-1.4; 13 0.75,1.4; 14 0.25,1.4; 15 -0.25,1.4; 16 -0.75,1.4 | smd 1.6 x 1.6: 17 0,0
QFN65P700X700X80-33N = smd 1.01 x 0.32: 1 -3.36,2.275; 2 -3.36,1.625; 3 -3.36,0.975; 4 -3.36,0.325; 5 -3.36,-0.325; 6 -3.36,-0.975; 7 -3.36,-1.625; 8 -3.36,-2.275; 17 3.36,-2.275; 18 3.36,-1.625; 19 3.36,-0.975; 20 3.36,-0.325; 21 3.36,0.325; 22 3.36,0.975; 23 3.36,1.625; 24 3.36,2.275 | smd 0.32 x 1.01: 9 -2.275,-3.36; 10 -1.625,-3.36; 11 -0.975,-3.36; 12 -0.325,-3.36; 13 0.325,-3.36; 14 0.975,-3.36; 15 1.625,-3.36; 16 2.275,-3.36; 25 2.275,3.36; 26 1.625,3.36; 27 0.975,3.36; 28 0.325,3.36; 29 -0.325,3.36; 30 -0.975,3.36; 31 -1.625,3.36; 32 -2.275,3.36 | smd 4.7 x 4.7: 33 0,0
MICROCHIP_MIC5365-1_8YD5-TR_0 = smd 1 x 0.66: 1 -1.315,0.95; 2 -1.315,0; 3 -1.315,-0.95; 4 1.315,-0.95; 5 1.315,0.95
XTALL_CSTCE8M00G52 = smd 1.4 x 0.4: P$1 0,1.2; P$2 0,0; P$3 0,-1.2

### Placement (x,y rotation side)
+1.8V  27.84,43.42 90 bottom
C1  22.8,76.27 270 bottom
C2  14.87,76.64 270 bottom
C3  11,76.79 90 bottom
C4  16.4,76.63 270 bottom
C5  13.03,76.79 90 bottom
C6  19.53,65.27 0 bottom
C7  20.1,63.49 180 bottom
C8  23.54,22.34 0 top
C9  11.78,22.11 90 top
C10  12.37,37.63 0 top
C11  19.89,30.49 270 top
C12  22.63,26.79 270 top
C13  23.54,24.07 180 top
C14  16.25,57.44 270 top
C15  12.11,53.38 0 top
C16  13.1,57.44 270 top
C17  17.88,57.44 270 top
C18  21.51,30.49 270 top
C19  20.01,38.7 180 top
C20  18.11,30.49 90 top
C21  16.46,30.49 90 top
C22  20.85,41.44 270 top
C23  16.25,41.47 270 top
C24  13.15,30.49 270 top
C25  14.81,30.49 270 top
C27  12.42,34.2 0 top
C28  20.01,34.79 180 top
C29  18.54,42.33 0 top
C30  20.76,14.55 270 top
C31  13.8,14.57 270 top
C32  16.86,46.88 0 top
C33  26.82,41.75 0 top
C34  14.68,57.44 270 top
C35  21.64,48.88 180 top
C36  21.28,54.62 270 top
C37  21.64,50.89 180 top
C38  20.24,46.88 180 top
C39  8.89,41.49 270 top
C40  13.56,41.47 270 top
C41  11.25,42.36 180 top
C42  13,46.85 180 top
C43  9.52,46.85 0 top
C44  26.87,47.97 0 top
C45  20.01,36.64 0 top
D1  20.09,63.88 180 top
FB1  9.1,76.54 270 bottom
FB3  10.39,44.62 270 top
FB4  19.38,44.64 270 top
FB5  17.7,44.64 270 top
FB6  12.14,44.62 270 top
GND  25.76,43.42 270 bottom
J1  17.32,3.82 0 top
J2  27.3,9.82 60 top
J3  7.41,9.69 300 top
J4  17.32,86.53 270 top
P1  17.32,44.95 0 top
Q2  25.19,38.88 180 top
R  25.44,73.8 0 top
R1  21.17,60.91 270 bottom
R2  17.15,64.41 90 bottom
R3  15.21,64.79 90 bottom
R4  23.85,76.93 270 top
R5  28.14,38.93 90 top
R6  20.44,58.03 0 top
R7  21.89,68.62 270 top
R8  19.35,67.73 0 top
R9  10.72,78.22 90 top
R10  11.27,69.86 180 bottom
R11  11.27,71.52 180 bottom
R12  11.27,73.19 180 bottom
R13  11.27,68.21 180 bottom
R14  11.27,66.56 180 bottom
SWD  6.45,74.89 270 top
U1  18.46,70.66 270 bottom
U2  16.91,51.91 270 top
U3  16.08,36.51 270 top
U5  17.27,24.09 180 top
U6  26.82,44.72 270 top
X1  19.9,76.68 270 bottom

### Tracks (layer width: path | path; a pad name or v marks a point on that pad's centre or on a via)
+1.8V  (via drill 0.25 pad 0.51)
  Top 0.254: U2.5 16.66,55.24 17.88,56.45 C17.2 | U2.32 21.16,53.66 C36.2 | U2.23 18.16,48.85 18.39,48.63 19.1,48.63
  Top 0.381: C36.2 21.62,54.12 v22.45,54.12 | C17.2 18.22,56.94 v18.82,56.94
  Top 0.508: 19.1,48.63 20.53,48.63 C35.2 20.79,48.01 v20.8,47.99
  Bottom 0.635: +1.8V.P$1 28.57,43.42 v28.9,43.09 | v22.45,54.12 21.74,54.12 20.98,54.88 20.98,55.82 19.86,56.94 v18.82,56.94
  Bottom 0.762: v22.45,54.12 19.5,51.17 19.5,48.63 20.14,47.99 v20.8,47.99 23.8,45 27.33,45 27.84,44.49 +1.8V.P$1
  other vias: 28.7,42 29.61,42.38
  pour Top (isolate 0.254, no thermals): 27.51,43.93 27.51,42.3 27.1,41.9 27.1,41.09 27.25,40.93 29.59,40.93 29.92,41.26 29.92,43.75 29.54,44.13 27.71,44.13
  pour Bottom (isolate 0.254, no thermals): 27.81,44.36 27.81,43.68 27.4,43.27 27.4,42.08 27.91,41.57 29.64,41.57 29.97,41.9 29.97,43.88 29.49,44.36
+12V  (via drill 0.25 pad 0.51)
  Top 0.305: U5.4 21.4,23.77 21.53,23.64 21.53,23.43 21.54,23.43 21.54,23.22 21.64,23.12 | U5.3 21.64,23.12 | 21.64,23.12 21.71,23.12 | U5.22 12.55,23.12 12.55,23.41 12.55,23.54 12.78,23.77 U5.21
  Top 0.508: C9.2 12.1,22.96 12.55,23.41 | C8.1 22.49,22.34 21.71,23.12 | C12.1 v21.65,27.64 v21.64,27.62
  Route15 0.508: v21.64,27.62 21.64,22.32 v22.5,21.45
  other vias: 10.92,23.2 10.36,22.44 9.75,23.2 23.44,21.32 15.42,11.09 16.84,11.09 18.29,11.06 19.53,11.09 16.1,12.05 17.52,12.1 18.82,12.13 15.36,12.94 16.79,12.97 18.13,13.04 19.43,13.04 18.74,14.03 17.4,14.03 15.97,13.98 20.09,14.11 21.43,14.11 14.42,14.09 13.21,14.09 22.02,13.04 22.04,11.95 22.04,10.91
  pour Top (isolate 0.254, no thermals): 12.67,14.09 12.67,3.19 13.18,2.68 13.48,2.38 15.24,2.38 16.66,2.38 16.81,2.53 16.96,2.68 16.96,3.34 16.96,7.15 17.57,7.76 18.46,8.65 20.29,8.65 21.87,8.65 22.37,9.16 22.5,9.28 22.5,12.26 22.5,13.63 22.04,14.09 21.71,14.42 18.39,14.42 13,14.42
  pour Top (isolate 0.254, no thermals): 12.75,23.76 11.38,23.76 11.22,23.61 9.73,23.61 9.62,23.51 9.32,23.2 9.32,22.95 9.32,22.42 9.52,22.21 9.62,22.11 10.26,22.11 10.77,22.11 10.97,22.32 11.15,22.49 12.16,22.49 12.47,22.49 12.62,22.65 12.75,22.77
  pour Top (isolate 0.254, no thermals): 21.94,23.13 23.14,23.13 23.29,22.98 23.29,21.91 23.92,21.27 23.92,20.74 23.72,20.54 23.26,20.54 23.09,20.71 22.55,20.71 22.25,21.02 22.25,22.37 21.94,22.67
  pour Route15 (isolate 0.254): 9.37,23.66 23.37,23.66 23.95,23.08 24.41,22.62 24.41,20.77 24.41,12.33 22.81,10.73 22.25,10.17 18.59,10.17 13.18,10.17 10.84,12.51 8.86,14.49 8.86,21.88 8.86,23.15
AUDIO_JACK_IN_L  (via drill 0.25 pad 0.51)
  Top 0.381: R9.1 12.76,77.37 J4.2 13.62,68.93 13.05,68.37 13.05,61.35 11.94,60.24 11.94,56.96 9.98,55 9.98,50.41 7.62,48.05 v7.62,39.13 | v19.73,39.84 19.86,39.84 20.86,38.84 C19.1
  Bottom 0.381: v7.62,39.13 13.84,39.13 14.55,39.84 v19.73,39.84
AUDIO_JACK_IN_R
  Top 0.381: J4.3 16.61,81.22 10.77,81.22 9.57,80.02 9.57,74.87 12.14,72.3 12.14,61.71 11.25,60.82 11.25,57.49 9.19,55.44 9.19,50.81 6.86,48.48 6.86,37.61 10.26,34.2 C27.1
C
  Bottom 0.178: U1.36 15.71,66.81 15.21,66.31 R3.2 15.21,65.29 14.7,65.29 13.69,64.28 8.96,64.28 8.61,64.63 8.61,72.73 6.5,74.84
  Bottom 0.381: SWD.1 SWD.2 6.5,74.84
CODEC_IRQN_OUT  (via drill 0.25 pad 0.51)
  Top 0.178: U2.4 17.16,55.1 17.83,55.77 18.68,55.77 19.59,56.68 R6.1 19.59,58.75 20.57,59.73 20.57,61.19 v22.39,63.01
  Bottom 0.178: U1.20 22.81,69.91 23.11,69.61 24.81,69.61 25.03,69.39 25.03,64.39 23.8,63.16 22.54,63.16 v22.39,63.01
CODEC_LOUT_N
  Top 0.254: U2.21 17.16,48.35 17.71,47.8 C32.2
  Top 0.381: C32.2 17.71,45.5 FB5.1
CODEC_LOUT_P
  Top 0.254: U2.22 17.66,48.62 18.31,47.97 19.07,47.97 19.39,47.65 C38.2
  Top 0.381: C38.2 19.39,45.51 FB4.1
CODEC_ROUT_N
  Top 0.254: U2.20 16.66,48.33 16.15,47.82 12.39,47.82 12.15,47.58 C42.2
  Top 0.381: C42.2 12.15,45.48 FB6.1
CODEC_ROUT_P
  Top 0.254: U2.19 16.16,48.62 15.8,48.25 11.77,48.25 C43.2
  Top 0.381: C43.2 10.39,46.84 FB3.1
D
  Bottom 0.178: SWD.3 8.25,70.55 8.25,64.43 8.77,63.92 12.7,63.92 13.61,63.01 16.02,63.01 16.21,63.19 U1.35
DC_JACK_DETECT  (via drill 0.25 pad 0.51)
  Top 0.203: U3.10 15.82,34.64 15.26,34.08 v15.26,34.05 | v16.2,38.93 16.32,38.8 U3.2
  Top 0.254: J4.4 18.07,70.82 15.54,68.29 15.54,62.85 v14.96,62.27
  Top 0.381: R4.2 23.67,76.08 21.44,73.85 18.45,73.85 J4.4
  Route15 0.203: v15.26,34.05 15.87,34.66 15.87,35.04 16.05,35.22 17.12,35.22 17.42,35.52 17.42,37.25 16.81,37.86 16.43,37.86 16.33,37.96 16.33,38.8 v16.2,38.93
  Route15 0.254: v14.96,62.27 13.89,61.2 13.89,58.92 15.11,57.7 15.11,46.67 14.8,46.37 14.8,44.06 16.2,42.66 v16.2,38.93
GND  (via drill 0.25 pad 0.51, 0.35)
  Top 0.381: D1.C 20.14,64.68 v21.41,64.68
  Top 0.457: v8.07,80.63 8.07,80.51 7.44,79.87 7.44,79.36 6.88,78.8 v6.07,78.8
  Bottom 0.254: 18.71,66.66 18.71,66.49 19.03,66.17 19.56,66.17 20.37,65.37 20.37,65.27
  Bottom 0.305: C6.1 20.37,65.27 20.03,65.27 | 18.71,66.66 U1.30 18.71,67.92 18.7,67.94 18.7,67.69 18.46,67.93 U1.49
  Bottom 0.381: X1.P$2 19.9,78.01 v19.89,78.03 | C6.1 20.71,65.6 v21.28,65.6 | P1.PAD_PD17 26.08,58.91 | P1.PAD_PD26 8.71,59.06 | 32.39,43.55 v32.38,43.55 | P1.PAD_PD24 9.06,30.38 v9.06,32.63 | v26.49,32.55 25.05,31.11 P1.PAD_PD19 | 2.13,43.66 v2.13,43.5 | P1.PAD_PD27 1.38,74.41 | 30.5,74.99 v30.48,74.97 | P1.PAD_PD28 9.2,89.14 | P1.PAD_PD15 23.76,89.31 | v21.41,64.68 21.41,63.85 C7.2
  Bottom 0.508: R3.1 15.1,63.82 v14.22,63.82 | C1.1 21.98,77.94 v21.92,77.94
  Bottom 0.813: 26.08,58.91 v26.08,57.44 | 8.71,59.06 v8.71,57.42 | P1.PAD_PD18 32.39,43.55 | P1.PAD_PD25 2.13,43.66 | 1.38,74.41 v3.81,74.41 | P1.PAD_PD16 30.5,74.99 | 9.2,89.14 v11.55,89.14 | 23.76,89.31 v23.47,89.02
  other vias: 11.45,87.57 22.3,88.36 22.15,89.19 30.45,73.85
  pour Bottom (isolate 0.254, rank 4, no thermals): -3.05,29.43 34.44,29.43 35.76,30.75 35.76,89.65 33.75,91.66 0.28,91.66 -3.71,87.67 -3.71,30.09
  pour Route2 (isolate 0.254, rank 4, no thermals): 7.19,61.33 34.62,61.33 35.53,62.24 36.6,63.31 36.6,72.1 36.6,88.91 34.87,90.64 34.11,91.4 5.74,91.4 0.68,91.4 -1.15,89.57 -1.76,88.96 -1.76,72.45 -1.76,62.88 -0.69,61.81 -0.21,61.33
GND1  (via drill 0.25 pad 0.51, 0.35)
  Top 0.178: U2.18 15.66,48.83 15.52,48.68 14.7,48.68 v14.45,48.93 | U3.17 16.07,36.54 v16.53,37 | U3.17 v15.62,36.97 | U3.17 v15.62,36.06 | U3.17 v16.53,36.06
  Top 0.254: U2.1 19.37,54.34 v19.81,54.78 | U2.9 14.48,54.06 v14.12,54.42 | U5.13 v16.94,28.41 | U3.17 15.82,36.76 U3.6
  Top 0.305: U5.23 13.16,22.47 12.98,22.29 12.98,21.96 13.13,21.81 13.9,21.81 U5.24 13.91,21.44 13.49,21.02 v13.23,21.02 | C9.1 11.77,21.25 v10.84,21.25 | U5.2 21.51,22.47 21.69,22.29 21.69,21.86 21.59,21.76 20.69,21.76 U5.1 20.63,21.41 21.07,20.97 v21.46,20.97
  Top 0.381: C36.1 21.55,55.21 v22.43,55.21 | C37.1 22.48,50.88 v22.48,49.95 | J4.1 13.48,87.49 v13.48,85.97 | U6.2 26.82,46.7 v26.54,46.98 26.02,47.5 C44.1 | C10.1 10.34,37.63 v10,37.96 | C45.2 21.92,36.64 v21.94,36.67 | v22.02,34.99 21.99,34.96 21.04,34.96 C28.1 | Q2.2 25.25,39.83 v25.25,39.82 | C33.1 26.23,41.48 v26.23,40.78
  Top 0.508: C35.1 22.49,47.93 v22.5,47.92 | C15.1 11.26,54.38 v11.25,54.4 | C16.1 13.08,58.32 v13.08,59.27 | v14.73,59.3 14.68,59.25 C34.1 | C14.1 16.28,58.32 v16.28,59.3 | C17.1 17.83,58.34 v17.83,59.27 | C42.1 13.85,45.87 v13.87,45.86 | C32.1 16.01,45.87 v16,45.86 | C38.1 21.09,45.95 v21.11,45.94 | C43.1 8.67,45.87 v8.68,45.86 | v25.35,22.32 25.32,22.34 C8.2 | C21.2 16.36,31.45 v16.36,32.37 | C20.2 18.11,32.32 v18.06,32.37 | C33.1 25.97,41.97 26.69,42.7 v26.76,42.7
  Bottom 0.305: v17.43,77.58 17.43,77.56 17.43,75.64 17.88,75.19 17.96,75.19 18.71,74.44 U1.7
  Bottom 0.508: 17.43,77.56 17.35,77.48 C4.1 14.89,77.48 C2.1 13.28,77.49 C5.2 C3.2 | R1.2 21.06,60.16 v19.86,60.16
  Bottom 0.635: GND.P$1 26.04,43.42 v26.76,42.7
  other vias: 16.91,51.91 16.23,52.59 17.62,52.62 17.62,51.19 16.2,51.19 17.27,24.09 15.87,24.12 18.62,24.12 18.62,25.46 17.24,25.46 15.87,25.46 15.87,22.72 17.27,22.7 18.59,22.7 8.1,21.6 7.08,20.46 5.99,19.37 4.92,18.28 3.86,17.26 26.24,21.55 27.2,20.59 28.17,19.65 29.13,18.71 30.22,17.69 31.75,17.69 2.49,17.24 8.1,22.95 8.73,24.27 26.24,23.03 26.26,24.42 25.09,25.49 8.07,25.26 7.52,26.13 6.91,25.11 7.72,24.17 23.97,26.96 23.97,28.08 26.29,27.17 27.12,25.97 27.73,24.93 1.75,15.91 1.9,13.35 2.64,12.13 3.48,10.78 4.26,9.59 5.08,8.24 1.34,14.49 6.5,5.58 7.46,3.85 8.35,2.4 9.24,0.98 11.07,0.98 12.82,0.88 15.11,1.64 17.07,0.83 19.12,1.61 20.72,0.9 22.73,0.88 24.69,0.85 25.98,1.87 26.87,3.29 28.42,5.96 29.23,7.56 30.1,8.95 30.91,10.4 32.41,12.74 33.25,14.19 33.02,16.02 31.54,16.12 30.55,14.31 32.08,14.31 24.86,3.09 22.83,3.09 23.85,4.31 22.83,5.65 21.64,4.31 20.47,5.6 21.56,6.82 19.23,6.77 18.16,5.6 9.34,3.9 11.25,3.85 10.31,5.14 11.86,5.17 10.31,2.58 11.96,2.53 3.22,15.46 3.71,13.88 31.01,18.96 30.35,78.75 30.43,72.12 26.97,64.35 26.57,56.48 31.04,76.98 2.31,72.91 3.6,73.01 7.79,56.88 7.36,55.87 27.28,55.64 31.98,42.38 31.19,42.89 3.27,42.89 2.82,41.75 4.72,47.21 4.57,40.04 27.25,33.64 7.57,33.52 23.64,83.48
  pour Top (isolate 0.254, rank 4, no thermals): -2.77,-1.69 33.65,-1.69 35.48,0.14 36.93,1.59 36.93,91.17 35.02,93.08 8.94,93.08 -1.81,93.08 -4.19,90.69 -5.18,89.7 -5.18,1.33 -5.18,0.73
  pour Route2 (isolate 0.254, rank 4, no thermals): 18.89,60.87 33.83,60.87 34.97,59.73 35.63,59.07 35.63,1.51 35.63,1.46 33.65,-0.52 33.27,-0.9 9.14,-0.9 0.78,-0.9 -1.15,1.03 -1.43,1.31 -1.43,14.31 -1.43,58.15 0.02,59.6 1.29,60.87
  pour Bottom (isolate 0.254, rank 4): 6.75,28.77 35.79,28.77 36.65,27.9 37.41,27.14 37.41,7.02 37.41,0.27 36.27,-0.88 35.63,-1.51 12.62,-1.51 1.29,-1.51 -0.23,0.01 -0.87,0.65 -0.87,14.39 -0.87,27.17 0.07,28.11 0.73,28.77
I2C_SCL  (via drill 0.25 pad 0.51)
  Top 0.178: U2.2 18.16,54.96 18.26,55.06 19.12,55.06 20.62,56.55 22.04,56.55 22.55,57.06 22.55,58.94 21.77,59.73 21.77,61 23.37,62.6 23.37,63.41 22.63,64.15 22.63,64.73 v23.11,65.22 | v22.96,67.32 22.34,67.32 R7.2
  Route15 0.178: v22.96,67.32 22.96,66.77 23.11,66.61 v23.11,65.22
  Bottom 0.178: U1.25 22.92,67.28 v22.96,67.32
I2C_SDA  (via drill 0.25 pad 0.51)
  Top 0.178: U2.3 17.66,55.04 18.03,55.41 18.97,55.41 20.55,56.99 21.92,56.99 22.17,57.24 22.17,58.8 21.38,59.58 21.38,61.13 23.01,62.75 23.01,63.26 22.22,64.05 v22.22,65.27 | R8.2 21.07,66.87 22.12,66.87 v22.38,66.61
  Route15 0.178: v22.22,65.27 22.22,66.46 v22.38,66.61
  Bottom 0.178: U1.26 20.71,66.85 20.88,66.69 22.3,66.69 v22.38,66.61
I2S_CLK  (via drill 0.25 pad 0.51)
  Top 0.178: U2.30 20.33,52.66 20.44,52.54 22.63,52.54 24.05,53.96 v24.33,53.96
  Route15 0.178: v24.61,71.52 24.3,71.22 24.3,70.32 25.22,69.41 25.22,63.84 22.91,61.53 22.91,58.21 23.62,57.49 23.62,54.67 v24.33,53.96
  Bottom 0.178: U1.16 22.79,71.91 23.2,71.5 24.59,71.5 v24.61,71.52
I2S_MCK  (via drill 0.25 pad 0.51)
  Top 0.178: U2.31 20.36,53.16 20.62,52.9 22.35,52.9 24.34,54.89 v24.34,54.9
  Route15 0.178: v24.34,54.9 24.34,57.35 23.42,58.28 23.42,61.53 25.63,63.74 25.63,69.53 24.99,70.17 v24.99,70.7
  Bottom 0.178: U1.17 22.7,71.41 23.42,70.7 v24.99,70.7
I2S_SD  (via drill 0.25 pad 0.51)
  Top 0.178: U2.28 19.99,51.66 20.14,51.8 20.16,51.8 20.19,51.83 24.15,51.83 v24.25,51.93
  Route15 0.178: v24.25,51.93 24.94,52.62 24.94,57.34 23.87,58.41 23.87,61.46 26.08,63.67 26.08,70.45 v25.98,70.55
  Bottom 0.178: U1.18 22.59,70.91 23.16,70.35 23.54,70.35 23.92,69.97 25.37,69.97 25.96,70.55 v25.98,70.55
I2S_WS  (via drill 0.25 pad 0.51)
  Top 0.178: U2.29 20.01,52.16 20.04,52.19 23.09,52.19 23.9,53 v23.98,53
  Route15 0.178: v23.98,53 23.19,53.79 23.19,57.32 22.45,58.05 22.45,61.69 24.81,64.05 24.81,69.28 23.87,70.22 23.87,72.05 v23.7,72.23
  Bottom 0.178: U1.15 23.51,72.41 v23.7,72.23
N$1
  Bottom 0.178: U1.8 19.21,74.93 18.7,75.44 X1.P$1
N$2
  Bottom 0.178: U1.9 19.71,74.82 21.1,76.21 X1.P$3
N$3
  Bottom 0.254: U1.34 16.71,65.69 R2.2
N$4  (via drill 0.25 pad 0.51)
  Top 0.305: D1.A 20.09,61.99 19.63,61.53 17.37,61.53 17.12,61.79 v17.12,62.4
  Bottom 0.254: R2.1 17.12,63.53 v17.12,62.4
N$5
  Top 0.381: FB6.2 12.14,42.39 C41.1 13.52,42.36 C40.1
N$6
  Top 0.254: U5.14 16.29,29.48 C21.1
N$7
  Top 0.305: U5.7 22.41,25.72 C12.2
N$8
  Top 0.254: U3.15 18,36.76 18.23,37 18.23,37.43 18.39,37.58 21.66,37.58 21.99,37.91 21.99,39.45 C22.2
N$9
  Top 0.254: C23.2 16.25,40.53 15.39,39.66 15.39,38.84 15.82,38.41 U3.3
N$10
  Top 0.305: U5.6 21.6,25.07 21.71,24.96 24.18,24.96 24.39,24.74 C13.1
N$11
  Top 0.254: U3.7 13.77,36.26 13.33,35.83 9.95,35.83 8.61,37.17 8.61,40.36 C39.2
N$12
  Bottom 0.305: U1.10 20.21,74.65 21.18,75.62 22.5,75.62 22.73,75.39 22.78,75.39 C1.2
  Bottom 0.381: R.1 23.84,75.39 22.73,75.39
N$13  (via drill 0.25 pad 0.51)
  Top 0.254: C40.2 12.81,39.87 9.98,39.87 9.24,39.13 9.24,37.53 10.28,36.49 v12.82,36.49 | v16.36,34.2 16.32,34.23 U3.11
  Bottom 0.254: v12.82,36.49 14.12,36.49 14.65,35.95 14.65,35.45 14.96,35.14 16.02,35.14 16.33,34.84 16.33,34.23 v16.36,34.2
N$14
  Top 0.254: U3.1 16.82,38.2 17.32,38.7 C19.2
N$15
  Top 0.305: C13.2 22.34,24.42 U5.5
N$17
  Top 0.254: C27.2 14.49,34.2 15.32,35.04 U3.9
N$18
  Top 0.381: FB4.2 19.38,42.34 C29.2 20.81,42.33 C22.1
N$19
  Top 0.381: FB5.2 17.7,42.34 C29.1 17.68,42.32 C23.1
N$20
  Top 0.381: FB3.2 10.39,42.37 C41.2 C39.1
N$21
  Top 0.254: C10.2 13.47,37.63 13.55,37.54 13.83,37.26 U3.5
N$22
  Top 0.254: U3.13 18.22,35.76 19.16,34.82 C28.2
N$23
  Top 0.254: U2.8 15.16,54.75 14.63,55.28
  Top 0.381: 14.63,55.28 14.55,55.36 14.02,55.36 13.1,56.27 C16.2
N$24
  Top 0.254: C14.2 16.16,56.5 U2.6
N$25
  Top 0.254: U2.7 15.66,55.1 14.68,56.09 C34.2
N$26
  Top 0.254: C11.2 19.23,28.98 19.23,28.44 18.89,28.11 U5.10
N$27  (via drill 0.25 pad 0.51)
  Top 0.254: C11.1 19.89,32.45 v19.94,32.5 | U3.16 17.48,37.79 17.7,38.01 v17.7,38.04
  Bottom 0.254: v17.7,38.04 19.94,35.8 v19.94,32.5
N$28  (via drill 0.25 pad 0.51)
  Top 0.254: U3.4 14.88,37.91 14.45,38.34 v14.46,38.36 | v21.38,32.48 21.38,31.47 C18.1
  Bottom 0.254: v14.46,38.36 14.76,38.06 16.58,38.06 17.34,38.83 18.29,38.83 21.28,35.83 21.28,32.58 v21.38,32.48
N$29  (via drill 0.25 pad 0.51)
  Top 0.254: C24.1 13.15,32.2 v13.61,32.65 | U3.8 14.44,35.76 v14.02,35.35
  Bottom 0.254: v14.02,35.35 14.02,33.06 v13.61,32.65
N$30
  Top 0.254: C25.1 14.8,32.45 15.54,33.19 16.76,33.19 17.19,33.62 17.19,34.75 U3.12
N$33
  Top 0.254: U5.9 19.54,27.76 20.25,28.47 21.21,28.47 21.51,28.77 C18.2
N$34
  Top 0.254: U5.16 14.99,27.83 14.88,27.83 13.15,29.55 C24.2
N$35
  Top 0.254: U2.10 13.19,53.16 C15.2
N$36
  Top 0.178: C20.1 19,30.53 19,32.96 19.55,33.52 22.7,33.52 23.98,34.79 23.98,38.86 Q2.3
  Top 0.254: U5.12 17.59,29.02 18.11,29.53 C20.1
N$37
  Top 0.254: U5.15 15.64,28.28 14.8,29.12 C25.2
N$39  (via drill 0.25 pad 0.51)
  Top 0.178: U5.19 12.59,25.07 v11.43,26.23
  Route15 0.178: v11.43,26.23 11.07,26.58 11.07,39.76 12.42,41.11 12.42,55.41 11.63,56.2 11.63,68.16 10.69,69.1 v9.34,69.1
  Bottom 0.178: R13.1 9.54,69.1 v9.34,69.1
N$40  (via drill 0.25 pad 0.51)
  Top 0.178: v10.36,26.3 10.36,26.28 12.22,24.42 U5.20
  Route15 0.178: v9.29,68.16 9.98,68.16 11.25,66.89 11.25,55.89 12.01,55.13 12.01,41.37 10.61,39.97 10.61,27.14 10.36,26.89 v10.36,26.3
  Bottom 0.178: R14.1 10.43,66.62 9.29,67.76 v9.29,68.16
N$41  (via drill 0.25 pad 0.51)
  Top 0.254: U5.11 18.24,28.35 v18.32,28.43
  Route15 0.178: v18.32,28.43 18.89,29 18.89,40.73 15.4,44.22 15.4,46.11 15.57,46.27 15.57,60.24 15.8,60.47 15.8,63.59 12.93,66.46 12.93,69.48 v9.27,73.14
  Bottom 0.178: R12.1 10.37,73.14 v9.27,73.14
N$42  (via drill 0.25 pad 0.51)
  Top 0.178: U5.17 13.52,26.37 v12.8,27.09
  Route15 0.178: v12.8,27.09 12.01,27.88 12.01,39.61 13.21,40.81 13.21,55.92 12.42,56.71 12.42,69.23 10.08,71.57 v9.34,71.57
  Bottom 0.178: R11.1 9.39,71.51 v9.34,71.57
N$43  (via drill 0.25 pad 0.51)
  Top 0.178: v11.88,26.99 13.16,25.72 U5.18
  Route15 0.178: v9.32,70.58 10.16,70.58 12.01,68.72 12.01,56.48 12.85,55.64 12.85,50.46 12.82,50.43 12.82,40.93 11.53,39.64 11.53,27.34 v11.88,26.99
  Bottom 0.178: R10.1 9.71,70.58 v9.32,70.58
N$44
  Top 0.178: R5.1 27.99,37.93 Q2.1
OUTL+  (via drill 0.25 pad 0.51)
  other vias: 20.16,20.61 20.9,19.98 21.38,19.19 20.39,19.17 19.48,19.65 22.02,19.85 22.7,19.32
  pour Top (no thermals): 18.84,21.15 20.14,21.15 20.98,20.31 22.73,20.31 23.14,19.9 23.14,18.99 22.96,18.81 19.33,18.81 18.82,19.32 18.82,21.12
  pour Bottom (isolate 0.254, no thermals): 18.77,21.25 18.77,19.11 19.86,18.02 23.72,18.02 25.4,16.35 25.4,11.42 27.2,9.62 28.93,9.62 29.84,10.53 29.84,16.93 25.52,21.25
OUTL-  (via drill 0.25 pad 0.51)
  other vias: 18.03,18.51 18.89,18.02 18.03,17.46 19,16.9 18.18,16.4 19.15,15.97 18.34,15.48
  pour Top (no thermals): 18.34,21.17 18.34,19.14 19.68,17.79 19.68,15.33 19.38,15.03 17.83,15.03 17.52,15.33 17.52,21.1 17.6,21.17
  pour Bottom (isolate 0.254, no thermals): 17.6,19.01 18.39,19.01 19.78,17.62 23.54,17.62 24.94,16.22 24.94,11.24 26.95,9.23 27.89,9.23 28.5,8.62 28.52,8.62 28.52,7.2 27.43,6.11 23.75,6.11 17.47,12.38 17.47,18.89
OUTR+  (via drill 0.25 pad 0.51)
  other vias: 16.53,18.56 15.57,18 16.48,17.51 15.54,16.85 16.43,16.47 15.42,15.86 16.3,15.46
  pour Top (no thermals): 16.2,21.17 16.2,19.14 14.88,17.82 14.88,15.28 15.19,14.97 16.76,14.97 17.02,15.23 17.02,21.1 16.94,21.17
  pour Bottom (isolate 0.254, no thermals): 16.91,18.96 16.13,18.96 14.73,17.57 10.97,17.57 9.57,16.17 9.57,11.19 7.57,9.18 6.63,9.18 6.02,8.57 5.99,8.57 5.99,7.15 7.08,6.06 10.77,6.06 17.04,12.33 17.04,18.84
OUTR-  (via drill 0.25 pad 0.51)
  other vias: 13.13,19.83 14.14,20.33 13.74,19.14 14.48,19.6 15.26,19.14 12.47,19.27 11.73,19.83
  pour Top (no thermals): 15.69,21.15 14.4,21.15 13.56,20.31 11.35,20.31 11.17,20.13 11.17,18.96 11.33,18.81 15.34,18.81 15.72,19.19 15.72,21.12
  pour Bottom (isolate 0.254, no thermals): 15.69,21.22 15.69,19.09 14.63,18.02 10.82,18.02 9.06,16.27 9.06,11.39 7.26,9.59 5.53,9.59 4.62,10.5 4.62,16.9 8.94,21.22
PWR_AMP_FSEL1
  Bottom 0.178: R13.2 12.23,68.21 13,68.99 13,69.89 14.03,70.91 U1.43
PWR_AMP_FSEL2
  Bottom 0.178: U1.42 14.04,70.41 13.38,69.76 13.38,68.82 12.98,68.42 12.98,67.41 R14.2
PWR_AMP_GAIN1
  Bottom 0.178: U1.45 12.66,71.91 12.27,71.51 R11.2
PWR_AMP_GAIN2
  Bottom 0.178: U1.44 13.61,71.41 12.12,69.93 R10.2
PWR_AMP_MUTE  (via drill 0.25 pad 0.51)
  Top 0.178: v29.33,39.87 29.24,39.78 R5.2
  Route15 0.178: v29.33,39.87 26.06,39.87 22.88,43.04 22.88,45.05 19.45,48.48 19.45,53.4 17.07,55.79 17.07,60.9 16.38,61.58 16.38,65.11 v14.58,66.92
  Bottom 0.178: U1.39 14.59,68.91 14.47,68.8 14.47,68.09 14.25,67.86 14.25,67.25 v14.58,66.92
PWR_AMP_SHDN
  Bottom 0.178: U1.46 13.8,72.41 13.03,73.19 R12.2
USART1_RX  (via drill 0.25 pad 0.51)
  Top 0.178: v17.42,66.41 21.66,66.41 22.07,66 24,66 24.51,66.51 24.51,67.88 25.19,68.57 25.78,68.57 27.05,69.84 27.05,71.82 27.89,72.66 v27.89,79.36
  Bottom 0.178: U1.32 17.71,66.7 v17.42,66.41 | v27.89,79.36 27.89,80.32 P1.PAD_PD1
USART1_TX  (via drill 0.25 pad 0.51)
  Top 0.178: v24.13,69.01 25.59,69.01 26.64,70.07 26.64,72.12 27.18,72.66 27.18,79.61 P1.PAD_PU1
  Bottom 0.178: U1.29 19.21,66.83 19.45,66.59 20.32,66.59 20.62,66.28 21.77,66.28 22.09,65.95 24.23,65.95 24.61,66.33 24.61,68.11 24.13,68.59 v24.13,69.01
USART2_RX
  Bottom 0.178: 29.05,69.1 29.71,68.45 29.71,67.93 | 29.71,67.93 P1.PAD_PD2 | U1.14 23.9,72.91 24.46,72.35 27.43,72.35 29.05,70.73 29.05,68.59 29.71,67.93
USART2_TX  (via drill 0.25 pad 0.51)
  Top 0.178: v29.69,70.88 29.71,70.86 P1.PAD_PU2
  Bottom 0.178: U1.13 23.95,73.41 24.64,72.73 27.84,72.73 v29.69,70.88
USART3_RX  (via drill 0.25 pad 0.51)
  Top 0.178: v27.15,53.76 25.07,55.84 24.46,55.84 22.91,57.39 22.91,59.09 22.15,59.86 22.15,60.85 23.73,62.43 23.73,63.87 23.25,64.35 v23.25,64.38
  Route15 0.178: v23.25,64.38 23.25,64.43 23.77,64.95 23.77,66.79 v23.75,66.82
  Bottom 0.178: P1.PAD_PD3 28.79,52.14 27.18,53.76 v27.15,53.76 | v23.75,66.82 23.64,66.92 23.64,67.55 22.78,68.41 U1.23
USART3_TX  (via drill 0.25 pad 0.51)
  Top 0.178: P1.PAD_PU3 25.66,56.2 24.61,56.2 23.26,57.54 23.26,59.24 22.5,60 22.5,60.68 24.22,62.4 v24.22,64.5
  Route15 0.178: v23.17,68.91 23.17,68.35 24.34,67.18 24.34,66.57 24.33,66.56 24.33,64.62 v24.22,64.5
  Bottom 0.178: U1.22 v23.17,68.91
USART4_RX  (via drill 0.25 pad 0.51)
  Route15 0.203: v7.59,53.23 10.44,56.07 10.44,66.1 8.61,67.93 8.61,73.67 9.12,74.18 22.68,74.18 v22.78,74.08
  Bottom 0.203: U1.12 22.75,74.04 v22.78,74.08
  Bottom 0.254: P1.PAD_PD11 6.01,53.23 v7.59,53.23
USART4_TX  (via drill 0.25 pad 0.51)
  Top 0.254: P1.PAD_PU11 7.13,54.34 v7.17,54.34
  Route15 0.178: 14.3,74.69 21.26,74.69 v21.46,74.89
  Route15 0.203: v7.17,54.34 9.9,57.08 9.9,66.03 8.1,67.83 8.1,73.8 8.99,74.69 14.3,74.69
  Bottom 0.178: U1.11 20.71,74.55 21.05,74.89 v21.46,74.89
USART5_RX  (via drill 0.25 pad 0.51)
  Top 0.178: v9.27,64.89 7.36,64.89 v6.91,65.34
  Bottom 0.178: U1.40 14.46,69.41 14.12,69.08 14.12,68.5 13.71,68.1 13.71,65.5 13.15,64.94 9.32,64.94 v9.27,64.89 | v6.91,65.34 5.28,66.97 5.28,67.49 P1.PAD_PD12
USART5_TX  (via drill 0.25 pad 0.51)
  Top 0.178: v9.24,65.8 7.2,67.84 P1.PAD_PU12
  Bottom 0.178: U1.41 14.17,69.91 13.74,69.48 13.74,68.65 13.33,68.24 13.33,65.62 13,65.29 9.75,65.29 v9.24,65.8
USART6_RX
  Bottom 0.178: U1.48 15.08,74.16 14.91,74.33 14.78,74.46 14.73,74.51 8.28,74.51 8,74.79 8,79.59 5.45,82.14 P1.PAD_PD13
USART6_TX  (via drill 0.25 pad 0.51)
  Top 0.178: v6.63,79.91 4.93,81.61 P1.PAD_PU13
  Bottom 0.178: U1.47 13.91,72.91 13.43,73.39 13.43,73.9 13.21,74.13 7.87,74.13 7.62,74.39 7.62,78.93 v6.64,79.91 v6.63,79.91
VDD  (via drill 0.25 pad 0.51, 0.35)
  Top 0.254: U2.26 20.55,50.66 C37.2 | C45.1 19,36.64 18.62,36.26 U3.14
  Top 0.381: C37.2 20.79,49.98 v20.77,49.97 | U6.3 25.06,46.03 v25.04,46.01 | P1.PAD_PU16 33.84,75.24 | P1.PAD_PU27 0.8,75.44 | P1.PAD_PU26 9.01,60.48 | P1.PAD_PU17 25.07,61.08 | 2.16,46.35 v2.16,46.45 | P1.PAD_PU24 9.54,28.86 v8.18,27.5 | P1.PAD_PU19 v25.05,27.45 v25.04,27.45 | v32.39,46.45 v32.38,46.45 | v18.18,62.38 18.18,63.77 16.36,65.6 16.36,67.04 17.04,67.73 R8.1 | C45.1 19.16,36.4 19.84,35.73 v22.68,35.73
  Top 0.457: R7.1 19.31,69.47 18.5,68.66 R8.1
  Top 0.508: v21.05,59.02 21.05,58.61 21.07,58.6 21.07,58.26 R6.2 | R9.2 v10.72,80.02
  Top 0.813: P1.PAD_PU15 25.55,88.69 | v26.23,87.29 25.91,87.61 25.91,88.69 25.55,88.69 | 33.84,75.24 v32.46,76.62 | v2.38,77.03 1.06,75.71 | v8.33,62.52 9.01,61.84 9.01,60.48 | v26.39,62.65 26.39,62.4 25.07,61.08 | 2.16,46.35 P1.PAD_PU25 0.92,44.88 v2.54,44.88 | v32.39,46.45 P1.PAD_PU18 v31.93,44.99 v31.93,45 | 0.8,75.44 1.06,75.71 | 1.06,75.71 v2.74,75.71 | 25.55,88.69 25.12,88.69 v24.41,87.97 | P1.PAD_PU28 9.04,88.39 | 9.04,88.39 9.04,87.84 v8.46,87.26 | 9.04,88.39 v9.98,87.44 | P1.PAD_PU16 33.84,74.73 v32.48,73.38
  Bottom 0.305: U1.31 18.21,65.74 C6.2 | C7.1 19.15,63.39 19.15,63.35
  Bottom 0.381: v25.04,46.01 28.6,46.01 v29.56,46.98
  Bottom 0.508: FB1.1 9.03,77.39 8.73,77.69 v8.73,78.4 | C6.2 18.68,63.85 19.15,63.39 | C7.1 19.15,63.35 v18.18,62.38
  other vias: 28.6,48.83 29.54,48.25 28.75,47.61
  pour Top (isolate 0.254, no thermals): 27.51,45.53 27.51,46.95 27.38,47.08 27.12,47.33 27.12,47.46 27.12,48.86 27.38,49.11 27.43,49.16 28.65,49.16 29.64,49.16 29.99,48.81 30.05,48.76 30.05,47.74 30.05,46.27 29.79,46.01 29.31,45.53
  pour Route15 (isolate 0.254, rank 4, no thermals): 0.76,91.17 33.14,91.17 34.31,90.01 36.52,87.8 36.52,5.14 36.52,2 34.08,-0.44 33.35,-1.18 3.2,-1.18 0.38,-1.18 -1.15,0.34 -2.97,2.17 -2.97,79.24 -2.97,87.44
VDDA
  Bottom 0.254: U1.5 17.71,74.4 16.4,75.71 C4.2 | U1.6 U1.5 | U1.5 U1.4
  Bottom 0.508: C4.2 14.89,75.78 C2.2 | 13.08,75.79 C5.1 | 11.3,75.84 C3.1 9.26,75.84 FB1.2
  Bottom 0.635: C3.1 C5.1 14.82,75.84 C2.2

### Text on the board
tPlace: 3V3 | 3V3 | P6 | P1* | B | 3V3 | C | 3V3 | R | D | P5 | P2* | 3V3 | 3V3 | P4 | P3 | 3V3 | 3V3 | 3V3 | 3V3 | OUTL+ | OUTR- | OUTL- | OUTR+ | 12V | GND
bPlace: GND | GND | H07R80 | P6 | P1* | GND | GND | P5 | P2* | GND | GND | P4 | P3 | GND | GND | GND | GND | OUTR- | 10W | OUTL+ | 10W | OUTR+ | OUTL- | 12V | GND